# EAGLE design Teensy board (EAGLE 9.3.0)
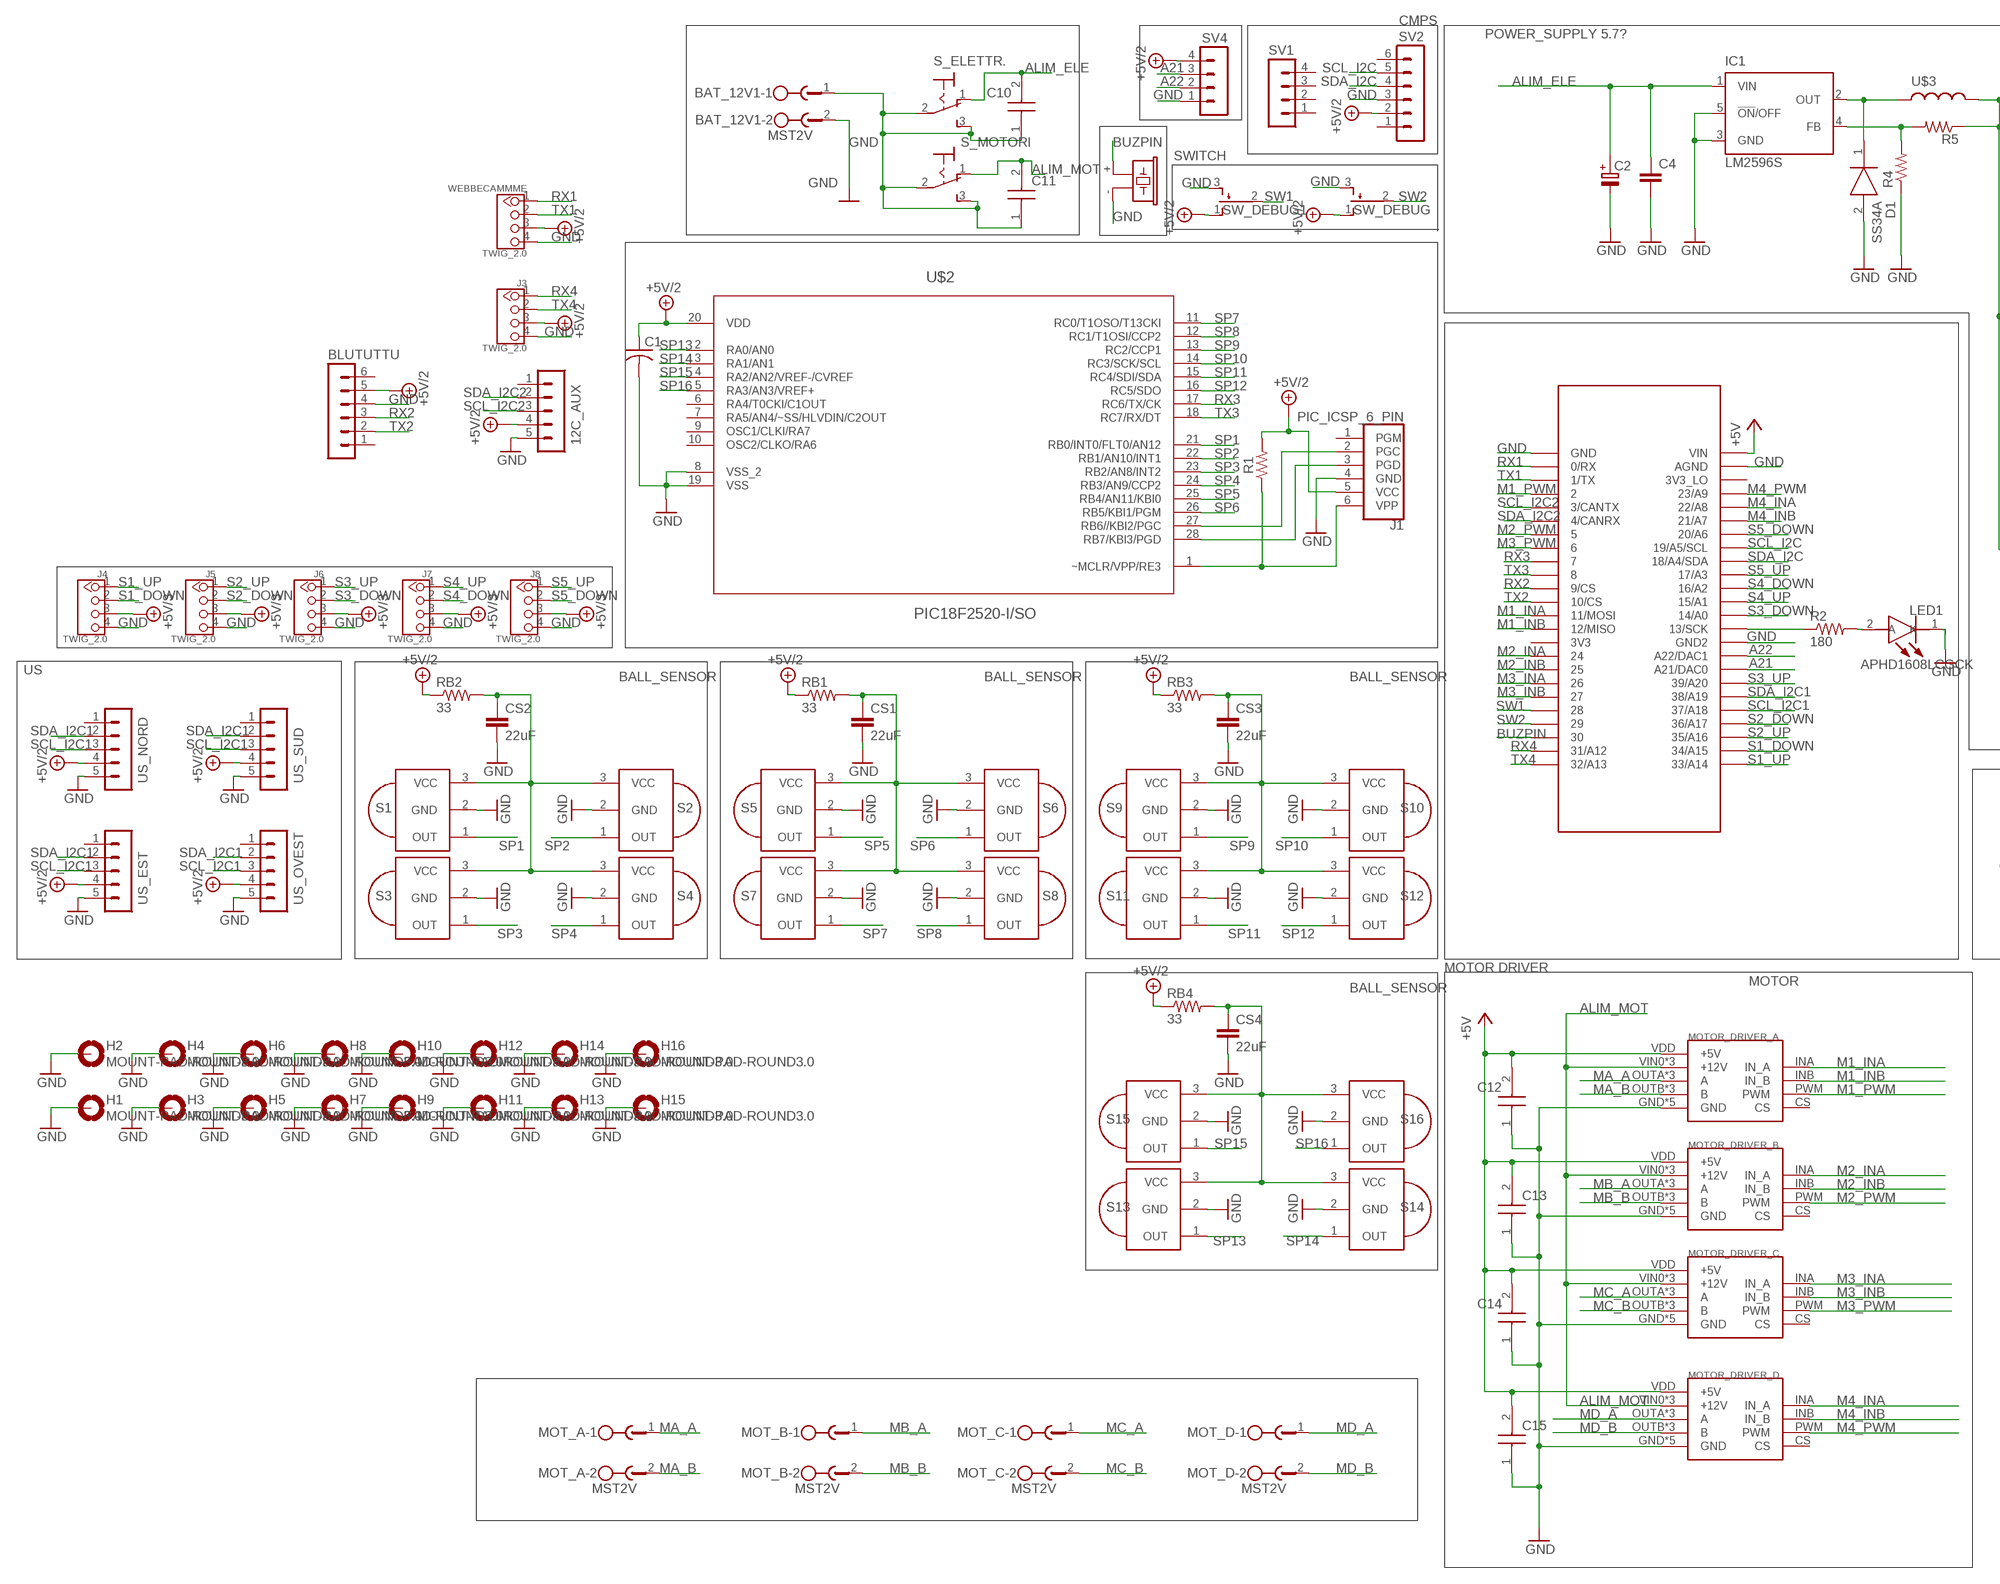
[diagram p0: schematic, sheet 1, part 1 of 2]
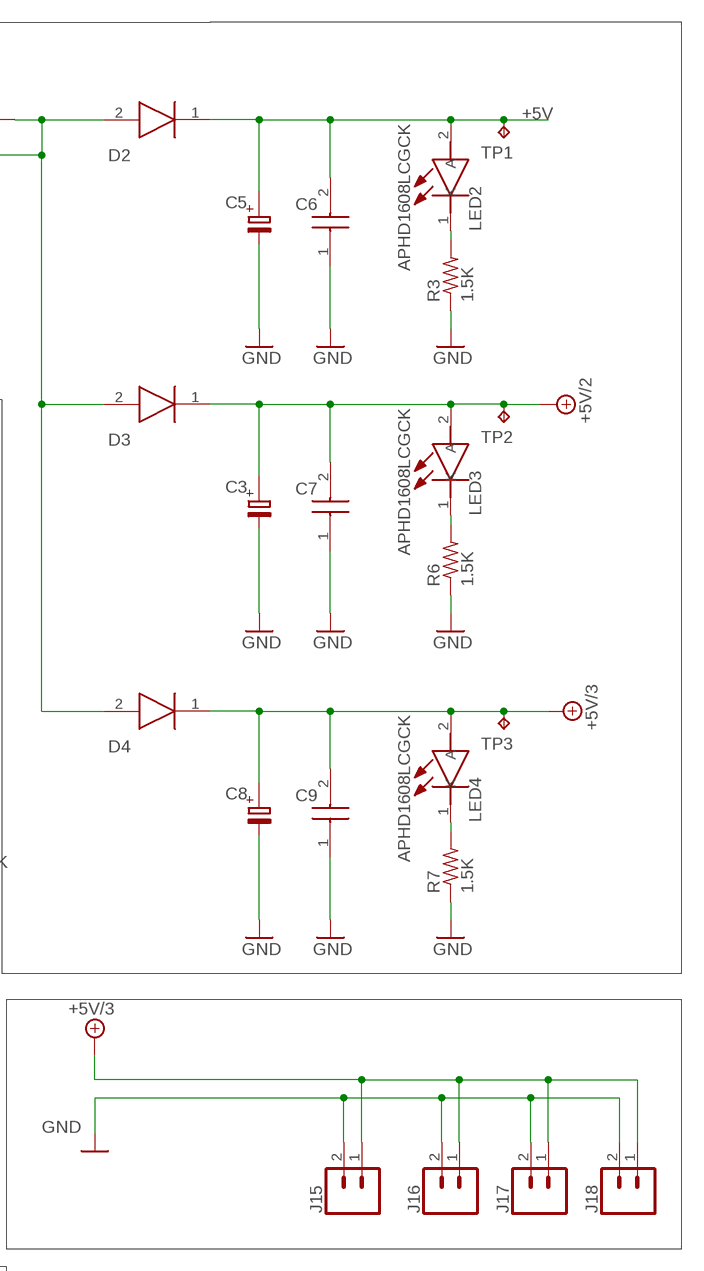
[diagram p1: schematic, sheet 1, part 2 of 2]

## Parts
12C_AUX  MA05-1  [MA05-1]
BAT_12V1  MST2V  [MSTBV2]
BLUTUTTU  MA06-1  [MA06-1]
C1  C-USC1206  [C1206]
C2  C-PR-SMD-SV-E/F  [SV-E/F]
C3  C-PR-SMD-SV-E/F  [SV-E/F]
C4  CC1206  [C1206]
C5  C-PR-SMD-SV-E/F  [SV-E/F]
C6  12065D106KAT2A  [CAPC3216X229N]
C7  12065D106KAT2A  [CAPC3216X229N]
C8  C-PR-SMD-SV-E/F  [SV-E/F]
C9  12065D106KAT2A  [CAPC3216X229N]
C10  12065D106KAT2A  [CAPC3216X229N]
C11  12065D106KAT2A  [CAPC3216X229N]
C12  12065D106KAT2A  [CAPC3216X229N]
C13  12065D106KAT2A  [CAPC3216X229N]
C14  12065D106KAT2A  [CAPC3216X229N]
C15  12065D106KAT2A  [CAPC3216X229N]
CS1  22uF  C-EUC1206  [C1206]
CS2  22uF  C-EUC1206  [C1206]
CS3  22uF  C-EUC1206  [C1206]
CS4  22uF  C-EUC1206  [C1206]
D1  SS34A  [DIOM5026X262N]
D2  SE20FG-M3_H  [SODFL3718X108N]
D3  SE20FG-M3_H  [SODFL3718X108N]
D4  SE20FG-M3_H  [SODFL3718X108N]
H1  MOUNT-PAD-ROUND3.0  [3,0-PAD]
H2  MOUNT-PAD-ROUND3.0  [3,0-PAD]
H3  MOUNT-PAD-ROUND3.0  [3,0-PAD]
H4  MOUNT-PAD-ROUND3.0  [3,0-PAD]
H5  MOUNT-PAD-ROUND3.0  [3,0-PAD]
H6  MOUNT-PAD-ROUND3.0  [3,0-PAD]
H7  MOUNT-PAD-ROUND3.0  [3,0-PAD]
H8  MOUNT-PAD-ROUND3.0  [3,0-PAD]
H9  MOUNT-PAD-ROUND3.0  [3,0-PAD]
H10  MOUNT-PAD-ROUND3.0  [3,0-PAD]
H11  MOUNT-PAD-ROUND3.0  [3,0-PAD]
H12  MOUNT-PAD-ROUND3.0  [3,0-PAD]
H13  MOUNT-PAD-ROUND3.0  [3,0-PAD]
H14  MOUNT-PAD-ROUND3.0  [3,0-PAD]
H15  MOUNT-PAD-ROUND3.0  [3,0-PAD]
H16  MOUNT-PAD-ROUND3.0  [3,0-PAD]
IC1  LM2596S  [TO263-5]
J1  PIC_ICSP_6_PIN  [MOLEX-1X6]
J3  TWIG_2.0  [2.0_1X4]
J4  TWIG_2.0  [2.0_1X4]
J5  TWIG_2.0  [2.0_1X4]
J6  TWIG_2.0  [2.0_1X4]
J7  TWIG_2.0  [2.0_1X4]
J8  TWIG_2.0  [2.0_1X4]
J15  CONN_02  [1X02]
J16  CONN_02  [1X02]
J17  CONN_02  [1X02]
J18  CONN_02  [1X02]
LED1  APHD1608LCGCK  [LEDM168X80N]
LED2  APHD1608LCGCK  [LEDM168X80N]
LED3  APHD1608LCGCK  [LEDM168X80N]
LED4  APHD1608LCGCK  [LEDM168X80N]
MOT_A  MST2V  [MSTBV2]
MOT_B  MST2V  [MSTBV2]
MOT_C  MST2V  [MSTBV2]
MOT_D  MST2V  [MSTBV2]
MOTOR_DRIVER_A  VNH5019  [VNH5019]
MOTOR_DRIVER_B  VNH5019  [VNH5019]
MOTOR_DRIVER_C  VNH5019  [VNH5019]
MOTOR_DRIVER_D  VNH5019  [VNH5019]
R1  10k  R-US_M1206  [M1206]
R2  180  R-US_M1206  [M1206]
R3  1.5K  R-US_R1206  [R1206]
R4  R-US_R1206  [R1206]
R5  R-US_R1206  [R1206]
R6  1.5K  R-US_R1206  [R1206]
R7  1.5K  R-US_R1206  [R1206]
RB1  33  R-US_M1206  [M1206]
RB2  33  R-US_M1206  [M1206]
RB3  33  R-US_M1206  [M1206]
RB4  33  R-US_M1206  [M1206]
S1  PNA460XM  [PNA460XM]
S2  PNA460XM  [PNA460XM]
S3  PNA460XM  [PNA460XM]
S4  PNA460XM  [PNA460XM]
S5  PNA460XM  [PNA460XM]
S6  PNA460XM  [PNA460XM]
S7  PNA460XM  [PNA460XM]
S8  PNA460XM  [PNA460XM]
S9  PNA460XM  [PNA460XM]
S10  PNA460XM  [PNA460XM]
S11  PNA460XM  [PNA460XM]
S12  PNA460XM  [PNA460XM]
S13  PNA460XM  [PNA460XM]
S14  PNA460XM  [PNA460XM]
S15  PNA460XM  [PNA460XM]
S16  PNA460XM  [PNA460XM]
S_ELETTR.  320-916  [320-916]
S_MOTORI  320-916  [320-916]
SG1  F/CM12P  [F/CM12P]
SV1  MA04-1  [MA04-1]
SV2  MA06-1  [MA06-1]
SV4  MA04-1  [MA04-1]
SW_DEBUG  TL38PO  [TL3XPO]
SW_DEBUG1  TL38PO  [TL3XPO]
TP1  TPTP13SQ  [TP13SQ]
TP2  TPTP13SQ  [TP13SQ]
TP3  TPTP13SQ  [TP13SQ]
U$1  TEENSY_3.5/3.6  [TEENSY_3.5/3.6]
U$2  PIC18F2520-I/SO  [SOIC127P1030X265-28N]
U$3  MSS1260  [MSS1260]
US_EST  MA05-1  [MA05-1]
US_NORD  MA05-1  [MA05-1]
US_OVEST  MA05-1  [MA05-1]
US_SUD  MA05-1  [MA05-1]
WEBBECAMMME  TWIG_2.0  [2.0_1X4]

## Nets
5.7V-DIRAMAZIONE2: D2.2(A) D3.2(A) D4.2(A) R5.1 U$3.P$1
+5V: C5.+ C6.2 D2.1(K) LED2.2(A) TP1.TP U$1.VIN
+5V/2: 12C_AUX.4 BLUTUTTU.5 C1.1 C3.+ C7.2 D3.1(K) J1.5(VCC) J3.3 LED3.2(A) R1.2 RB1.1 RB2.1 RB3.1 RB4.1 SV2.2 SV4.4 SW_DEBUG1.1(O) SW_DEBUG.1(O) TP2.TP U$2.20(VDD) US_EST.4 US_NORD.4 US_OVEST.4 US_SUD.4 WEBBECAMMME.3
+5V/3: C8.+ C9.2 D4.1(K) J4.3 J5.3 J6.3 J7.3 J8.3 J15.1 J16.1 J17.1 J18.1 LED4.2(A) TP3.TP
A21: SV4.3 U$1.21/DAC0(A21/DAC0)
A22: SV4.2 U$1.A22/DAC1
ALIM_ELE [Power]: C2.+ C4.1 C10.2 IC1.1(VIN) S_ELETTR..1(O)
ALIM_MOT [Power]: C11.2 MOTOR_DRIVER_A.VIN0(+12V) MOTOR_DRIVER_A.VIN1(+12V) MOTOR_DRIVER_A.VIN2(+12V) MOTOR_DRIVER_B.VIN0(+12V) MOTOR_DRIVER_B.VIN1(+12V) MOTOR_DRIVER_B.VIN2(+12V) MOTOR_DRIVER_C.VIN0(+12V) MOTOR_DRIVER_C.VIN1(+12V) MOTOR_DRIVER_C.VIN2(+12V) MOTOR_DRIVER_D.VIN0(+12V) MOTOR_DRIVER_D.VIN1(+12V) MOTOR_DRIVER_D.VIN2(+12V) S_MOTORI.1(O)
BUZPIN: SG1.+ U$1.30
GND [Power]: 12C_AUX.5 BAT_12V1.2 BLUTUTTU.4 C1.2 C2.- C3.- C4.2 C5.- C6.1 C7.1 C8.- C9.1 C12.1 C13.1 C14.1 C15.1 CS1.2 CS2.2 CS3.2 CS4.2 D1.2(A) H1.B3,0(MOUNT) H2.B3,0(MOUNT) H3.B3,0(MOUNT) H4.B3,0(MOUNT) H5.B3,0(MOUNT) H6.B3,0(MOUNT) H7.B3,0(MOUNT) H8.B3,0(MOUNT) H9.B3,0(MOUNT) H10.B3,0(MOUNT) H11.B3,0(MOUNT) H12.B3,0(MOUNT) H13.B3,0(MOUNT) H14.B3,0(MOUNT) H15.B3,0(MOUNT) H16.B3,0(MOUNT) IC1.3(GND) IC1.5(!ON!/OFF) J1.4(GND) J3.4 J4.4 J5.4 J6.4 J7.4 J8.4 J15.2 J16.2 J17.2 J18.2 LED1.1(K) MOTOR_DRIVER_A.GND MOTOR_DRIVER_A.GND0(GND) MOTOR_DRIVER_A.GND1(GND) MOTOR_DRIVER_A.GND2(GND) MOTOR_DRIVER_A.GND3(GND) MOTOR_DRIVER_B.GND MOTOR_DRIVER_B.GND0(GND) MOTOR_DRIVER_B.GND1(GND) MOTOR_DRIVER_B.GND2(GND) MOTOR_DRIVER_B.GND3(GND) MOTOR_DRIVER_C.GND MOTOR_DRIVER_C.GND0(GND) MOTOR_DRIVER_C.GND1(GND) MOTOR_DRIVER_C.GND2(GND) MOTOR_DRIVER_C.GND3(GND) MOTOR_DRIVER_D.GND MOTOR_DRIVER_D.GND0(GND) MOTOR_DRIVER_D.GND1(GND) MOTOR_DRIVER_D.GND2(GND) MOTOR_DRIVER_D.GND3(GND) R3.1 R4.1 R6.1 R7.1 S1.2(GND) S2.2(GND) S3.2(GND) S4.2(GND) S5.2(GND) S6.2(GND) S7.2(GND) S8.2(GND) S9.2(GND) S10.2(GND) S11.2(GND) S12.2(GND) S13.2(GND) S14.2(GND) S15.2(GND) S16.2(GND) SG1.- SV2.3 SV4.1 SW_DEBUG1.3(S) SW_DEBUG.3(S) U$1.AGND U$1.GND U$1.GND2 U$2.8(VSS_2) U$2.19(VSS) US_EST.5 US_NORD.5 US_OVEST.5 US_SUD.5 WEBBECAMMME.4
M1_INA: MOTOR_DRIVER_A.INA(IN_A) U$1.11/MOSI
M1_INB: MOTOR_DRIVER_A.INB(IN_B) U$1.12/MISO
M1_PWM: MOTOR_DRIVER_A.PWM U$1.2
M2_INA: MOTOR_DRIVER_B.INA(IN_A) U$1.24
M2_INB: MOTOR_DRIVER_B.INB(IN_B) U$1.25
M2_PWM: MOTOR_DRIVER_B.PWM U$1.5
M3_INA: MOTOR_DRIVER_C.INA(IN_A) U$1.26
M3_INB: MOTOR_DRIVER_C.INB(IN_B) U$1.27
M3_PWM: MOTOR_DRIVER_C.PWM U$1.6
M4_INA: MOTOR_DRIVER_D.INA(IN_A) U$1.22/A8
M4_INB: MOTOR_DRIVER_D.INB(IN_B) U$1.21/A7
M4_PWM: MOTOR_DRIVER_D.PWM U$1.23/A9
MA_A: MOT_A.1 MOTOR_DRIVER_A.OUTA2(A) MOTOR_DRIVER_A.OUTA3(A) MOTOR_DRIVER_A.OUTA(A)
MA_B: MOT_A.2 MOTOR_DRIVER_A.OUTB1(B) MOTOR_DRIVER_A.OUTB3(B) MOTOR_DRIVER_A.OUTB(B)
MB_A [Power]: MOT_B.1 MOTOR_DRIVER_B.OUTA2(A) MOTOR_DRIVER_B.OUTA3(A) MOTOR_DRIVER_B.OUTA(A)
MB_B [Power]: MOT_B.2 MOTOR_DRIVER_B.OUTB1(B) MOTOR_DRIVER_B.OUTB3(B) MOTOR_DRIVER_B.OUTB(B)
MC_A [Power]: MOT_C.1 MOTOR_DRIVER_C.OUTA2(A) MOTOR_DRIVER_C.OUTA3(A) MOTOR_DRIVER_C.OUTA(A)
MC_B [Power]: MOT_C.2 MOTOR_DRIVER_C.OUTB1(B) MOTOR_DRIVER_C.OUTB3(B) MOTOR_DRIVER_C.OUTB(B)
MD_A: MOT_D.1 MOTOR_DRIVER_D.OUTA2(A) MOTOR_DRIVER_D.OUTA3(A) MOTOR_DRIVER_D.OUTA(A)
MD_B: MOT_D.2 MOTOR_DRIVER_D.OUTB1(B) MOTOR_DRIVER_D.OUTB3(B) MOTOR_DRIVER_D.OUTB(B)
N$1: J1.6(VPP) R1.1 U$2.1(~MCLR/VPP/RE3)
N$2: J1.3(PGD) U$2.28(RB7/KBI3/PGD)
N$3: J1.2(PGC) U$2.27(RB6//KBI2/PGC)
N$4: R2.1 U$1.13/SCK
N$5: LED1.2(A) R2.2
N$6: C12.2 C13.2 C14.2 C15.2 D1.1(K) IC1.2(OUT) MOTOR_DRIVER_A.VDD(+5V) MOTOR_DRIVER_B.VDD(+5V) MOTOR_DRIVER_C.VDD(+5V) MOTOR_DRIVER_D.VDD(+5V) U$3.P$2 ; supply symbol labelled +5V
N$7: IC1.4(FB) R4.2 R5.2
N$8: LED2.1(K) R3.2
N$10: LED3.1(K) R6.2
N$12: LED4.1(K) R7.2
N$14: BAT_12V1.1 C10.1 C11.1 S_ELETTR..2(P) S_ELETTR..3(S) S_MOTORI.2(P) S_MOTORI.3(S)
POWER_BLOK_1: CS1.1 RB1.2 S5.3(VCC) S6.3(VCC) S7.3(VCC) S8.3(VCC)
POWER_BLOK_2: CS2.1 RB2.2 S1.3(VCC) S2.3(VCC) S3.3(VCC) S4.3(VCC)
POWER_BLOK_3: CS3.1 RB3.2 S9.3(VCC) S10.3(VCC) S11.3(VCC) S12.3(VCC)
POWER_BLOK_4: CS4.1 RB4.2 S13.3(VCC) S14.3(VCC) S15.3(VCC) S16.3(VCC)
RX1: U$1.0/RX WEBBECAMMME.1
RX2: BLUTUTTU.3 U$1.9/CS
RX3: U$1.7 U$2.17(RC6/TX/CK)
RX4: J3.1 U$1.31/A12
S1_DOWN: J4.2 U$1.34/A15
S1_UP: J4.1 U$1.33/A14
S2_DOWN: J5.2 U$1.36/A17
S2_UP: J5.1 U$1.35/A16
S3_DOWN: J6.2 U$1.14/A0
S3_UP: J6.1 U$1.39/A20
S4_DOWN: J7.2 U$1.16/A2
S4_UP: J7.1 U$1.15/A1
S5_DOWN: J8.2 U$1.20/A6
S5_UP: J8.1 U$1.17/A3
SCL_I2C: SV2.5 U$1.19/A5/SCL
SCL_I2C1: U$1.37/A18 US_EST.3 US_NORD.3 US_OVEST.3 US_SUD.3
SCL_I2C2: 12C_AUX.3 U$1.3/CANTX
SDA_I2C: SV2.4 U$1.18/A4/SDA
SDA_I2C1: U$1.38/A19 US_EST.2 US_NORD.2 US_OVEST.2 US_SUD.2
SDA_I2C2: 12C_AUX.2 U$1.4/CANRX
SP1: S1.1(OUT) U$2.21(RB0/INT0/FLT0/AN12)
SP2: S2.1(OUT) U$2.22(RB1/AN10/INT1)
SP3: S3.1(OUT) U$2.23(RB2/AN8/INT2)
SP4: S4.1(OUT) U$2.24(RB3/AN9/CCP2)
SP5: S5.1(OUT) U$2.25(RB4/AN11/KBI0)
SP6: S6.1(OUT) U$2.26(RB5/KBI1/PGM)
SP7: S7.1(OUT) U$2.11(RC0/T1OSO/T13CKI)
SP8: S8.1(OUT) U$2.12(RC1/T1OSI/CCP2)
SP9: S9.1(OUT) U$2.13(RC2/CCP1)
SP10: S10.1(OUT) U$2.14(RC3/SCK/SCL)
SP11: S11.1(OUT) U$2.15(RC4/SDI/SDA)
SP12: S12.1(OUT) U$2.16(RC5/SDO)
SP13: S13.1(OUT) U$2.2(RA0/AN0)
SP14: S14.1(OUT) U$2.3(RA1/AN1)
SP15: S15.1(OUT) U$2.4(RA2/AN2/VREF-/CVREF)
SP16: S16.1(OUT) U$2.5(RA3/AN3/VREF+)
SW1: SW_DEBUG1.2(P) U$1.28
SW2: SW_DEBUG.2(P) U$1.29
TX1: U$1.1/TX WEBBECAMMME.2
TX2: BLUTUTTU.2 U$1.10/CS
TX3: U$1.8 U$2.18(RC7/RX/DT)
TX4: J3.2 U$1.32/A13
Unconnected: 12C_AUX.1 BLUTUTTU.1 BLUTUTTU.6 J1.1(PGM) MOTOR_DRIVER_A.CS MOTOR_DRIVER_B.CS MOTOR_DRIVER_C.CS MOTOR_DRIVER_D.CS SV1.1 SV1.2 SV1.3 SV1.4 SV2.1 SV2.6 U$1.3V3 U$1.3V3_LO U$2.6(RA4/T0CKI/C1OUT) U$2.7(RA5/AN4/~SS/HLVDIN/C2OUT) U$2.9(OSC1/CLKI/RA7) U$2.10(OSC2/CLKO/RA6) US_EST.1 US_NORD.1 US_OVEST.1 US_SUD.1

## Notes on the sheet
- CMPS
- POWER_SUPPLY 5.7?
- SWITCH
- US
- BALL_SENSOR | BALL_SENSOR | BALL_SENSOR
- MOTOR DRIVER
- MOTOR
- BALL_SENSOR

## Library data of the parts
12C_AUX US_EST US_NORD US_OVEST US_SUD = con-lstb:MA05-1: PIN HEADER; OC_FARNELL: unknown; OC_NEWARK: unknown
BAT_12V1 MOT_A MOT_B MOT_C MOT_D = con-phoenix-508:MST2V: PHOENIX; OC_FARNELL: unknown; OC_NEWARK: unknown
BLUTUTTU SV2 = con-lstb:MA06-1: PIN HEADER; OC_FARNELL: unknown; OC_NEWARK: unknown
C1 = adafruit:C-US: CAPACITOR, American symbol
C2 C3 C5 C8 = cap-pan40:C-PR: POLARIZED ELECTROLYTIC/TANTALUM
C4 = eagle-ltspice:C: CAPACITOR, European symbol; SPICEMODEL: NONE; SPICEPREFIX: C
C6 C7 C9-C15 = 12065D106KAT2A:12065D106KAT2A: Multilayer Ceramic Capacitors MLCC - SMD/SMT 50V 10uF X5R 1206 10% HIGH CV Source: Datasheet <http://datasheets.avx.com/cx5r.pdf>; DESCRIPTION: Multilayer Ceramic Capacitors MLCC - SMD/SMT 50V 10uF X5R 1206 10% HIGH CV; HEIGHT: 2.29mm; MANUFACTURER_NAME: AVX; MANUFACTURER_PART_NUMBER: 12065D106KAT2A
CS1-CS4 = rcl:C-EU: CAPACITOR, European symbol
D1 = SamacSys_Parts:SS34A: HY Electronic Corp SS34A, SMT Rectifier Schottky Diode, 40V 3A, 2-Pin SMA Source: Datasheet <http://uk.rs-online.com/web/p/products/1711454>; DESCRIPTION: HY Electronic Corp SS34A, SMT Rectifier Schottky Diode, 40V 3A, 2-Pin SMA; HEIGHT: 2.62mm; MANUFACTURER_NAME: HY Electronic Corp; MANUFACTURER_PART_NUMBER: SS34A; RS_PART_NUMBER: 1711454
D2-D4 = SE20FG-M3_H:SE20FG-M3_H: Diode Rectifier 2A 400V Standard DO219AB Vishay SE20FG-M3/H, SMT Diode, 400V 2A, 920ns, 2-Pin DO-219AB Source: Datasheet <http://uk.rs-online.com/web/p/products/8949262P>; DESCRIPTION: Diode Rectifier 2A 400V Standard DO219AB Vishay SE20FG-M3/H, SMT Diode, 400V 2A, 920ns, 2-Pin DO-219AB; HEIGHT: 1.08mm; MANUFACTURER_NAME: Vishay; MANUFACTURER_PART_NUMBER: SE20FG-M3/H; RS_PART_NUMBER: 8949262P
H1-H16 = holes:MOUNT-PAD-ROUND: MOUNTING PAD, round
IC1 = national-semiconductor:LM2596: SIMPLE SWITCHER® Power Converter 150 kHz 3A Step-Down Voltage Regulator Source: http://www.national.com/ds/LM/LM2596.pdf; MF: NATIONAL SEMICONDUCTOR; MPN: LM2596S-ADJ/NOPB; OC_FARNELL: 9494367; OC_NEWARK: 41K3842
J1 = SparkFun-Connectors:PIC_ICSP_6_PIN: ISCP Programming connector for PICs This 6 pin header contains all the lines necessary for programming most PIC microcontrollers. Here is the connector we sell at SparkFun: Polarized Connectors - Header (6-Pin) <https://www.sparkfun.com/products/8094> (PRT-08094) It is used on this SparkFun product: SparkFun UDB5 - PIC UAV Development Board <https://www.sparkfun.com/products/11703> (DEV-11703) Also, if you need a nice PIC programmer, please check these out: MPLAB PICkit 3 <https://www.sparkfun.com/products/9973> (PGM-09973); PROD_ID: CONN-08046; SF_ID: PRT-08094
J3-J8 WEBBECAMMME = CONNECTER:TWIG_2.0
J15-J18 = SparkFun-Connectors:CONN_02: Multi connection point. Often used as Generic Header-pin footprint for 0.1 inch spaced/style header connections On any of the 0.1 inch spaced packages, you can populate with these: Break Away Headers - Straight <https://www.sparkfun.com/products/116> (PRT-00116) Break Away Male Headers - Right Angle <https://www.sparkfun.com/products/553> (PRT-00553) Female Headers <https://www.sparkfun.com/products/115> (PRT-00115) Break Away Headers - Machine Pin <https://www.sparkfun.com/products/117> (PRT-00117) Break Away Female Headers - Swiss Machine Pin <https://www.sparkfun.com/products/743> (PRT-00743) For SCREWTERMINALS and SPRING TERMINALS visit here: Screw Terimnals on SparkFun.com <https://www.sparkfun.com/search/results?term=Screw+Terminals> (5mm/3.5mm/2.54mm spacing) This device is also useful as a general connection point to wire up your design to another part of your project. Our various solder wires solder well into these plated through hole pads. Hook-Up Wire - Assortment (Stranded, 22 AWG) <https://www.sparkfun.com/products/11375> (PRT-11375) Hook-Up Wire - Assortment (Solid Core, 22 AWG) <https://www.sparkfun.com/products/11367> (PRT-11367) View the entire wire category on our website here <https://www.sparkfun.com/categories/141> Special notes: Molex polarized connector foot print use with: PRT-08233 with associated crimp pins and housings. 2.54_SCREWTERM for use with PRT-10571. 3.5mm Screw Terminal footprints for PRT-08084 5mm Screw Terminal footprints for use with PRT-08432
LED1-LED4 = SamacSys_Parts:APHD1608LCGCK: Standard LEDs - SMD 0603 Dome Lens LED Green- 570nm Source: Datasheet <http://www.mouser.com/datasheet/2/216/APHD1608LCGCK-1100472.pdf>; DESCRIPTION: Standard LEDs - SMD 0603 Dome Lens LED Green- 570nm; HEIGHT: 0.8mm; MANUFACTURER_NAME: Kingbright; MANUFACTURER_PART_NUMBER: APHD1608LCGCK; MOUSER_PART_NUMBER: 604-APHD1608LCGCK
MOTOR_DRIVER_A MOTOR_DRIVER_B MOTOR_DRIVER_C MOTOR_DRIVER_D = DRIVER POLOLU:VNH5019: aggiornato il 24/10/14 con pin cs (AD)
R1-R7 RB1-RB4 = adafruit:R-US_: RESISTOR, American symbol
S1-S16 = adafruit:PNA460XM: IR 38KHz receiver PNA4602 and related receivers http://www.ladyada.net/library/pcb/eaglelibrary.html
S_ELETTR. S_MOTORI = switch:320-916: TOGGLE SWITCH distributor RS Components
SG1 = buzzer:F/CM12P: BUZZER Source: Buerklin; OC_FARNELL: unknown; OC_NEWARK: unknown
SV1 SV4 = con-lstb:MA04-1: PIN HEADER; OC_FARNELL: unknown; OC_NEWARK: unknown
SW_DEBUG SW_DEBUG1 = switch:TL38PO: TINY SWITCH ON OFF MOM Source: http://www2.produktinfo.conrad.com/datenblaetter/700000-724999/705152-da-01-de-Subminiaturschalter_TL_36YO.pdf
TP1-TP3 = testpad:TP: Test pad
U$1 = Teensy356:TEENSY_3.5/3.6
U$2 = Microchip_By_element14_Batch_1:PIC18F2520-I/SO: Enhanced Flash Microcontroller; DESCRIPTION: Enhanced Flash Microcontroller; MPN: PIC18F2520-I/SO; OC_FARNELL: 9321241; OC_NEWARK: 89H0593; PACKAGE: SOIC-28; SUPPLIER: Microchip
U$3 = inductor-coilcraft:MSS1260: SMT Power Inductor

## Net classes
0 default: width 0.254 mm
1 Power: width 0.508 mm, clearance 0.508 mm
2 Power mot: width 1.93 mm

## Board
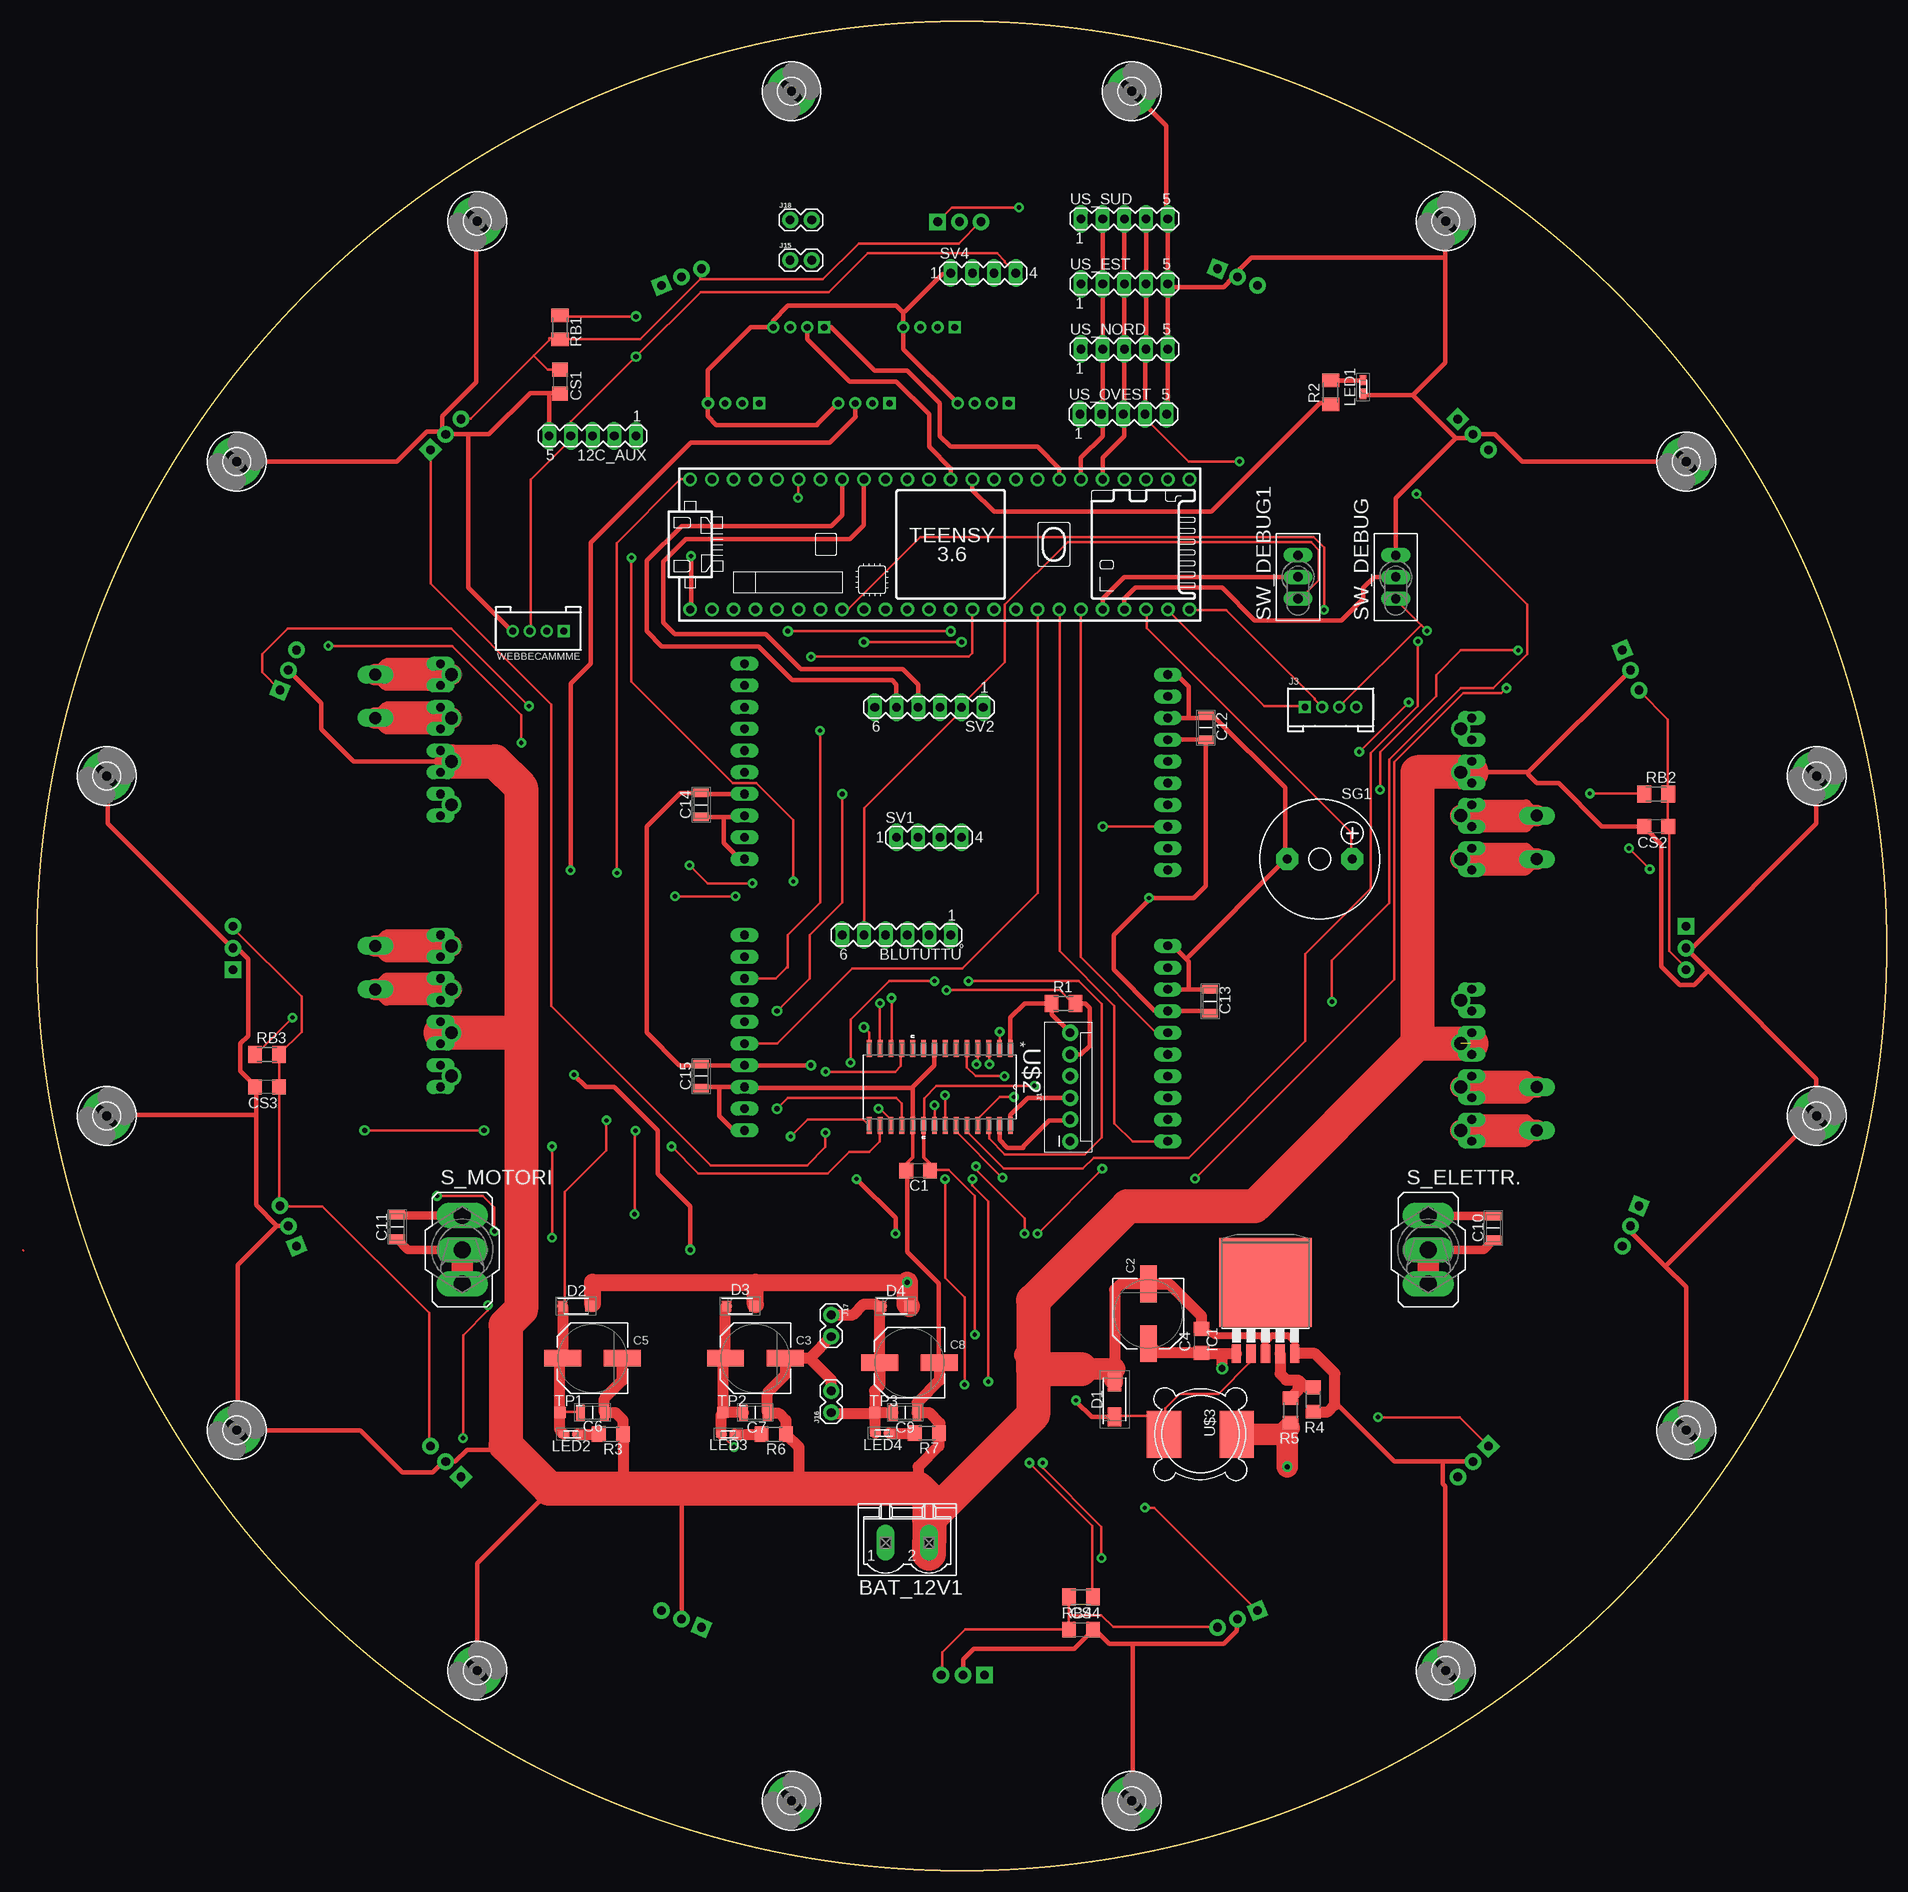
[diagram p2: board, top side]
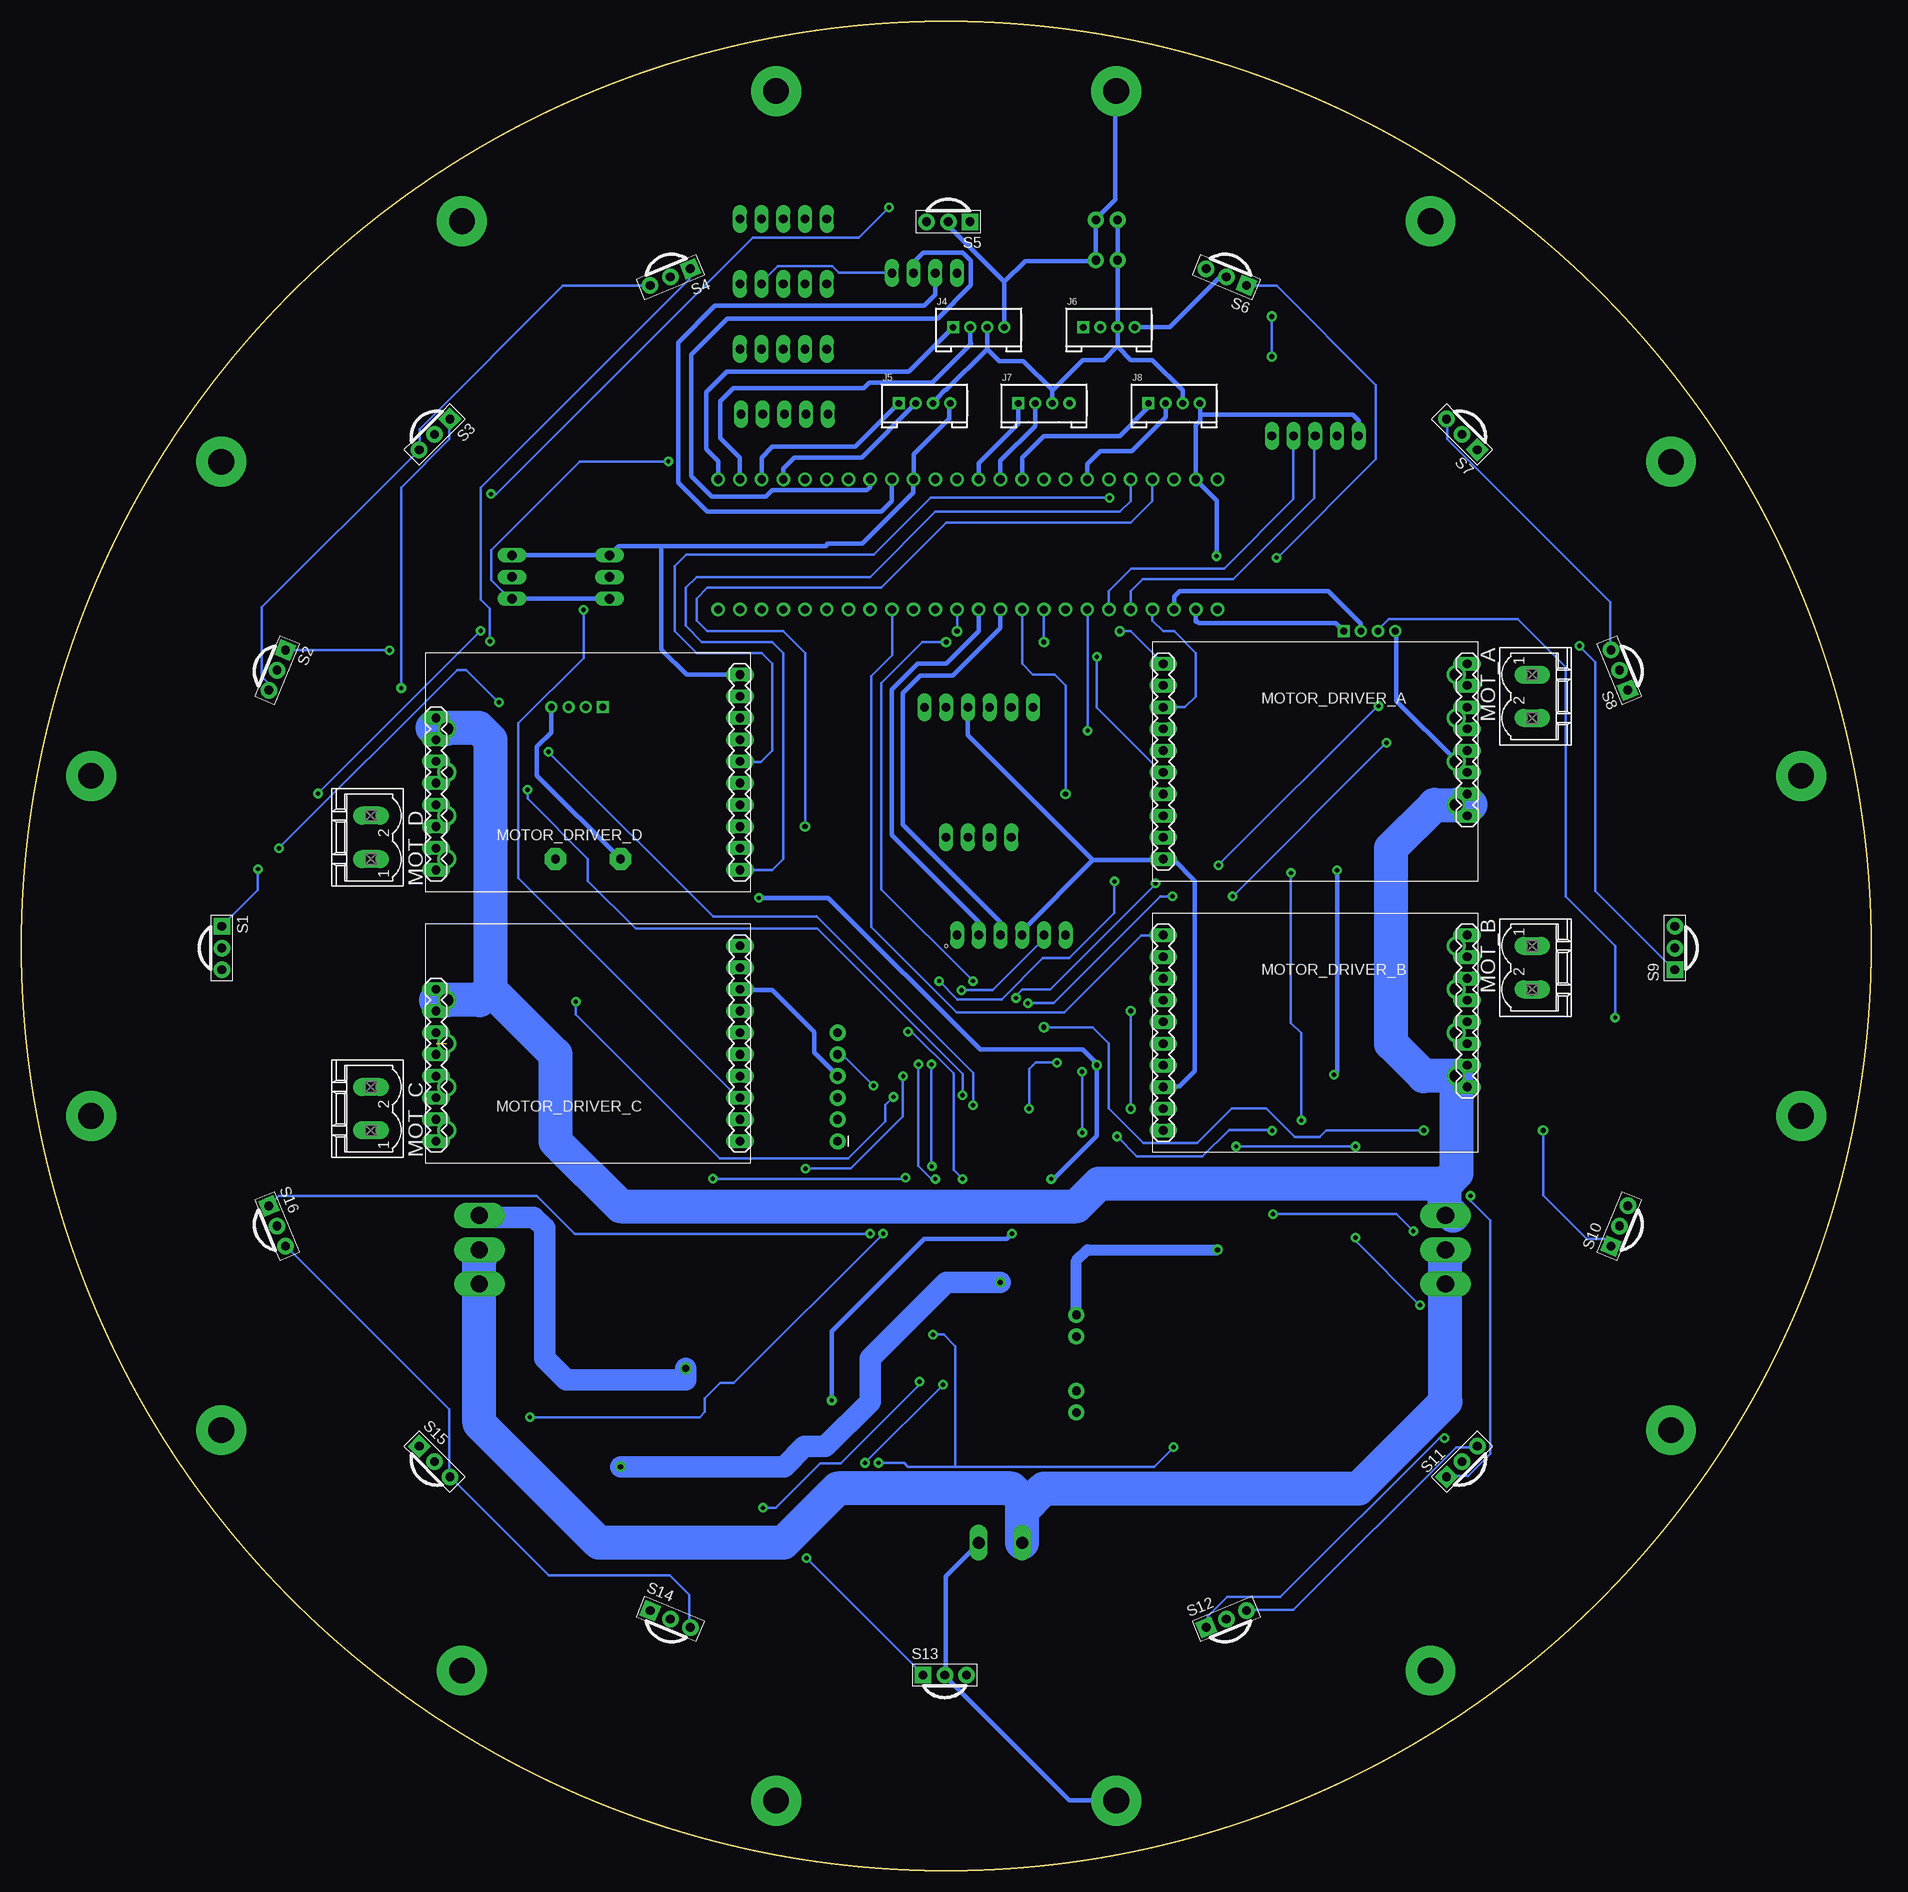
[diagram p3: board, bottom side, seen from below]

Size 216.41 x 216.41 mm. Coordinates in mm from the lower left corner, seen from the top.
Outline: circle at 108.2,108.2 radius 108.2
Copper layers (1*16): Top 0.035mm / dielectric 1.5mm / Bottom 0.035mm
Design rules "SparkFun-2-layer-STANDARD *": minimum track width 12mil, minimum drill 20mil, track to track 12mil, track to pad 12mil, pad to pad 12mil, via to via 12mil, smd to smd 12mil, copper to edge 12mil, drill to drill 12mil, minimum pad ring 12mil, minimum via ring 12mil, stop-mask expansion 4mil, vias tented up to drill 25mil, thermal gap 10mil
Holes 0.35 mm at 108.2,108.2

### Footprints (pad centres in the part's own frame; a part is rotated, then mirrored left to right if it is on the bottom)
MA05-1 = drill 1.016 long: 1 -5.08,0; 2 -2.54,0; 3 0,0; 4 2.54,0; 5 5.08,0
MSTBV2 = drill 1.397 long: 1 -2.54,0; 2 2.54,0
MA06-1 = drill 1.016 long: 1 -6.35,0; 2 -3.81,0; 3 -1.27,0; 4 1.27,0; 5 3.81,0; 6 6.35,0
C1206 = smd 1.6 x 1.8: 1 -1.4,0; 2 1.4,0
SV-E/F = smd 4.318 x 1.93: + -3.493,0; - 3.493,0
CAPC3216X229N = smd 1.02 x 1.82: 1 -1.4,0; 2 1.4,0
DIOM5026X262N = smd 2.2 x 1.55: 1 -2.05,0; 2 2.05,0
SODFL3718X108N = smd 1.12 x 1.22: 1 -1.6,0; 2 1.6,0
3,0-PAD = drill 3 pad 5.842: B3,0 0,0
TO263-5 = smd 1.067 x 2.159: 1 -3.404,-5.791; 2 -1.702,-5.791; 3 0,-5.791; 4 1.702,-5.791; 5 3.404,-5.791 | smd 10.8 x 10.41: 6 0,2.54
MOLEX-1X6 = drill 1.016 pad 1.88: 1 0,0; 2 2.54,0; 3 5.08,0; 4 7.62,0; 5 10.16,0; 6 12.7,0
2.0_1X4 = drill 0.8 pad 1.27 square: 1 -3,0 | drill 0.8 pad 1.27: 2 -1,0; 3 1,0; 4 3,0
1X02 = drill 1.016 pad 1.88: 1 0,0; 2 2.54,0
LEDM168X80N = smd 1.2 x 0.75: 1 -0.8,0; 2 0.8,0
VNH5019 = drill 1.016 long: CS 1.27,17.78; ENA 1.27,22.86; ENB 1.27,15.24; GND 1.27,7.62; GND0 36.83,12.7; GND1 1.27,2.54; GND2 36.83,15.24; INA 1.27,25.4; INB 1.27,12.7; OUTA 36.83,22.86; OUTA2 36.83,25.4; OUTB 36.83,17.78; OUTB1 36.83,20.32; PWM 1.27,20.32; VDD 1.27,10.16; VIN0 36.83,7.62; VIN1 36.83,10.16; VOUT 1.27,5.08 | drill 1.5: GND3 35.56,13.97; OUTA3 35.56,24.13; OUTB3 35.56,19.05; VIN2 35.56,8.89
M1206 = smd 1.6 x 2: 1 -1.4,0; 2 1.4,0
R1206 = smd 1.6 x 1.803: 1 -1.422,0; 2 1.422,0
PNA460XM = drill 1.016 pad 1.93 square: 1 -2.54,0 | drill 1.016 pad 1.93: 2 0,0; 3 2.54,0
320-916 = drill 2.007 long: 1 0,4.013; 2 0,0; 3 0,-4.013
F/CM12P = drill 1.016 pad 2.54 octagon: + 3.81,0; - -3.81,0
MA04-1 = drill 1.016 long: 1 -3.81,0; 2 -1.27,0; 3 1.27,0; 4 3.81,0
TL3XPO = drill 1.1 pad 1.422 long: 1 -2.54,0; 2 0,0; 3 2.54,0
TP13SQ = smd 1.3 x 1.3: TP 0,0
TEENSY_3.5/3.6 = drill 0.965: 0/RX -25.4,-7.62; 1/TX -22.86,-7.62; 2 -20.32,-7.62; 3/CANTX -17.78,-7.62; 3V3 7.62,-7.62; 3V3_LO -22.86,7.62; 4/CANRX -15.24,-7.62; 5 -12.7,-7.62; 6 -10.16,-7.62; 7 -7.62,-7.62; 8 -5.08,-7.62; 9/CS -2.54,-7.62; 10/CS 0,-7.62; 11/MOSI 2.54,-7.62; 12/MISO 5.08,-7.62; 13/SCK 5.08,7.62; 14/A0 2.54,7.62; 15/A1 0,7.62; 16/A2 -2.54,7.62; 17/A3 -5.08,7.62; 18/A4/SDA -7.62,7.62; 19/A5/SCL -10.16,7.62; 20/A6 -12.7,7.62; 21/A7 -15.24,7.62; 21/DAC0 12.7,7.62; 22/A8 -17.78,7.62; 23/A9 -20.32,7.62; 24 10.16,-7.62; 25 12.7,-7.62; 26 15.24,-7.62; 27 17.78,-7.62; 28 20.32,-7.62; 29 22.86,-7.62; 30 25.4,-7.62; 31/A12 27.94,-7.62; 32/A13 30.48,-7.62; 33/A14 30.48,7.62; 34/A15 27.94,7.62; 35/A16 25.4,7.62; 36/A17 22.86,7.62; 37/A18 20.32,7.62; 38/A19 17.78,7.62; 39/A20 15.24,7.62; A22/DAC1 10.16,7.62; AGND -25.4,7.62; GND -27.94,-7.62; GND2 7.62,7.62; VIN -27.94,7.62
SOIC127P1030X265-28N = smd 1.981 x 0.559: 1 -4.521,8.255; 2 -4.521,6.985; 3 -4.521,5.715; 4 -4.521,4.445; 5 -4.521,3.175; 6 -4.521,1.905; 7 -4.521,0.635; 8 -4.521,-0.635; 9 -4.521,-1.905; 10 -4.521,-3.175; 11 -4.521,-4.445; 12 -4.521,-5.715; 13 -4.521,-6.985; 14 -4.521,-8.255; 15 4.521,-8.255; 16 4.521,-6.985; 17 4.521,-5.715; 18 4.521,-4.445; 19 4.521,-3.175; 20 4.521,-1.905; 21 4.521,-0.635; 22 4.521,0.635; 23 4.521,1.905; 24 4.521,3.175; 25 4.521,4.445; 26 4.521,5.715; 27 4.521,6.985; 28 4.521,8.255
MSS1260 = smd 5.5 x 4: P$1 0,4.25; P$2 0,-4.25

### Placement (x,y rotation side)
12C_AUX  65.02,167.89 180 top
BAT_12V1  101.85,38.35 0 top
BLUTUTTU  100.58,109.47 180 top
C1  103.12,81.91 180 top
C2  130.05,65.15 90 top
C3  84.07,59.94 0 top
C4  136.27,61.98 90 top
C5  65.02,59.94 0 top
C6  65.02,53.59 180 top
C7  84.07,53.59 180 top
C8  102.11,59.44 0 top
C9  101.6,53.59 180 top
C10  170.43,75.18 90 top
C11  42.16,75.31 90 top
C12  136.78,133.73 270 top
C13  137.29,101.73 270 top
C14  77.72,124.71 90 top
C15  77.72,92.96 90 top
CS1  61.21,174.24 270 top
CS2  189.48,122.17 180 top
CS3  26.92,91.69 180 top
CS4  122.17,28.19 0 top
D1  126.11,55.12 90 top
D2  63.12,66.04 0 top
D3  82.3,66.04 0 top
D4  100.46,66.04 0 top
H1  208.24,128.1 0 top
H2  193.01,164.87 0 top
H3  164.87,193.01 0 top
H4  128.1,208.24 0 top
H5  88.3,208.24 0 top
H6  51.54,193.01 0 top
H7  23.39,164.87 0 top
H8  8.16,128.1 0 top
H9  8.16,88.3 0 top
H10  23.39,51.54 0 top
H11  51.54,23.39 0 top
H12  88.3,8.16 0 top
H13  128.1,8.16 0 top
H14  164.87,23.39 0 top
H15  193.01,51.54 0 top
H16  208.24,88.3 0 top
IC1  143.76,66.29 0 top
J1  120.9,85.34 90 top
J3  151.38,136.14 0 top
J4  104.39,180.59 0 bottom
J5  110.74,171.7 0 bottom
J6  89.15,180.59 0 bottom
J7  96.77,171.7 0 bottom
J8  81.53,171.7 0 bottom
J15  88.14,188.47 0 top
J16  92.96,53.59 90 top
J17  92.96,65.02 270 top
J18  88.14,193.17 0 top
LED1  155.19,173.61 90 top
LED2  62.48,51.05 180 top
LED3  80.9,51.05 180 top
LED4  98.93,51.18 180 top
MOT_A  39.62,137.41 270 bottom
MOT_B  39.62,105.66 270 bottom
MOT_C  175.51,89.15 90 bottom
MOT_D  175.51,120.9 90 bottom
MOTOR_DRIVER_A  84.07,115.82 0 bottom
MOTOR_DRIVER_B  84.07,84.07 0 bottom
MOTOR_DRIVER_C  131.06,110.74 180 bottom
MOTOR_DRIVER_D  131.06,142.49 180 bottom
R1  120.14,101.47 0 top
R2  151.38,172.97 90 top
R3  67.18,51.05 180 top
R4  149.35,55.12 90 top
R5  146.69,53.85 90 top
R6  86.23,51.05 180 top
R7  104.14,51.18 180 top
RB1  61.21,180.59 270 top
RB2  189.48,125.98 0 top
RB3  26.92,95.5 0 top
RB4  122.17,32 180 top
S1  192.95,107.95 270 bottom
S2  186.48,140.48 247.5 bottom
S3  168.06,168.06 225 bottom
S4  140.48,186.48 202.5 bottom
S5  107.95,192.95 180 bottom
S6  75.43,186.48 157.5 bottom
S7  47.85,168.06 135 bottom
S8  29.42,140.48 112.5 bottom
S9  22.95,107.95 90 bottom
S10  29.42,75.43 67.5 bottom
S11  47.85,47.85 45 bottom
S12  75.43,29.42 22.5 bottom
S13  108.36,22.86 0 bottom
S14  140.48,29.42 337.5 bottom
S15  168.06,47.85 315 bottom
S16  186.48,75.43 292.5 bottom
S_ELETTR.  162.81,72.64 0 top
S_MOTORI  49.78,72.64 0 top
SG1  150.11,118.36 0 top
SV1  104.39,120.9 0 top
SV2  104.39,136.14 180 top
SV4  110.74,186.94 0 top
SW_DEBUG  159,151.38 90 top
SW_DEBUG1  147.57,151.38 90 top
TP1  61.21,53.59 0 top
TP2  80.26,53.59 0 top
TP3  98.04,53.59 0 top
U$1  104.39,155.19 0 top
U$2  105.66,91.69 270 top
U$3  136.14,51.05 270 top
US_EST  127.25,185.67 0 top
US_NORD  127.25,178.05 0 top
US_OVEST  127.13,170.43 0 top
US_SUD  127.25,193.29 0 top
WEBBECAMMME  58.67,145.03 180 top

### Tracks (layer width: path | path; a pad name or v marks a point on that pad's centre or on a via)
5.7V-DIRAMAZIONE2  (via drill 0.6)
  Top 0.305: 140.74,50.88 140.34,51.28 U$3.P$1
  Top 1.016: U$3.P$1 140.77,50.68 | R5.1 145.8,51.54 145.8,51.05
  Top 1.27: D2.2 65.02,66.34 | v101.85,68.83 102.06,68.63 | D3.2 84.07,66.22
  Top 2: 65.02,66.34 65.02,68.83 84.07,68.83 | 84.07,68.83 v101.85,68.83 | 84.07,66.22 84.07,68.83
  Top 2.54: U$3.P$1 145.8,51.05 | 145.8,51.05 146.56,51.82 | v146.3,47.24 146.3,50.55 145.8,51.05 | v101.85,68.83 101.85,66.24 D4.2
  Bottom 2.54: v101.85,68.83 108.2,68.83 117.09,59.94 117.09,54.86 122.35,49.61 124.79,49.61 127.16,47.24 v146.3,47.24
+5V  (via drill 0.51)
  Top 0.305: C6.2 63.6,53.64 61.77,53.64 TP1.TP | v66.65,87.78 66.65,84.28 61.77,79.4 61.77,66.6 D2.1 | v67.87,116.74 67.87,148.74 67.84,148.77 67.84,155.35 75.31,162.81 U$1.VIN
  Top 1.27: D2.1 61.52,59.96 | 61.52,59.96 C5.+ | 61.52,59.96 61.21,59.65 TP1.TP 61.21,51.52 LED2.2
  Bottom 0.305: v66.65,87.78 66.65,97.99 67.87,99.21 v67.87,116.74
+5V/2  (via drill 0.51, 0.6)
  Top 0.305: v116.13,47.7 123.49,40.33 123.49,32 RB4.1 | v81.58,49.53 80.52,50.6 LED3.2 | v116.71,91.85 116.66,91.8 105.26,91.8 103.83,90.37 103.83,87.32 U$2.20 | BLUTUTTU.5 96.83,109.58 96.83,124.36 108.1,135.64 108.1,136.09 SV2.2 108.1,136.25 113.28,141.43 113.28,148.13 120.6,155.45 149.1,155.45 150.01,154.53 150.01,151.03 147.88,148.89 147.57,148.89 SW_DEBUG1.1 | v106.43,103.02 119.69,103.02 121.06,101.65 121.36,101.65 R1.2 | v109.75,62.71 109.75,78.97 106.73,81.99 104.6,81.99 C1.1 | v181.71,126.03 187.96,126.03 RB2.1 | 161.98,145.77 159,148.74 SW_DEBUG.1 | 161.98,145.77 v162.66,145.08 | 161.98,145.77 152.45,136.25 J3.3 | v29.92,99.82 25.65,95.55 RB3.1 | 57.81,145.08 WEBBECAMMME.3 57.81,145.24 57.81,162.76 62.38,167.33 62.38,167.79 12C_AUX.4 62.48,169.54 v70.1,177.16 77.67,184.73 92.69,184.73 97.23,189.28 112.37,189.28 113.28,188.37 113.28,188.21 SV4.4 | v140.72,164.9 134.77,164.9 129.74,169.93 129.74,170.23 US_OVEST.4 | RB1.1 61.34,181.86 v70.1,181.86
  Top 0.406: C1.1 104.52,82.67 103.76,83.44 U$2.20
  Top 0.508: J1.5 122.17,95.5 123.19,96.52 123.19,100.96 122.68,101.47 R1.2 | US_SUD.4 US_EST.4 US_NORD.4 129.67,177.93 US_OVEST.4
  Top 1.27: TP2.TP 80.26,59.63 C3.+ 80.58,65.93 D3.1 | C7.2 TP2.TP | LED3.2 80.1,53.43 TP2.TP
  Bottom 0.305: v116.13,47.7 113.13,47.7 112.67,47.24 107.11,47.24 | 107.11,47.24 83.87,47.24 v81.58,49.53 | J1.5 120.37,95.5 v116.71,91.85 | v106.43,103.02 102.77,103.02 96.83,108.97 96.83,109.42 BLUTUTTU.5 | 107.11,47.24 107.11,61.34 108.48,62.71 v109.75,62.71 | v162.66,145.08 v181.71,126.03 | SV4.4 114.66,187 120.75,187 121.51,187.76 127.91,187.76 129.9,185.78 US_EST.4 | v29.92,99.82 29.92,108.2 35.71,113.99 35.71,140.82 41.35,146.46 56.44,146.46 57.66,145.24 WEBBECAMMME.3 | v140.72,164.9 151.08,164.9 161.44,154.53 161.44,151.03 159.46,149.05 159.16,149.05 SW_DEBUG.1 | 108.1,136.7 108.1,136.25 SV2.2 | v70.1,181.86 v70.1,177.16
  Bottom 0.508: SW_DEBUG1.1 SW_DEBUG.1
+5V/3  (via drill 0.51, 0.6)
  Top 0.305: 95.77,170.16 95.81,170.13
  Top 0.508: v62.46,117.07 62.46,138.91 64.82,141.27 64.82,155.42 76.51,167.11 92.79,167.11 95.81,170.13 | v62.84,93.12 64.26,91.69 67.56,91.69 72.64,86.61 72.64,81.53 76.45,77.72 v76.45,72.64 | J7.3 95.77,170.16
  Top 1.27: TP3.TP 98.04,56.13 98.62,56.71 C8.+ 98.62,65.8 | TP3.TP C9.2 | LED4.2 98.13,53.5 | 98.13,53.5 TP3.TP | 98.62,65.8 D4.1 | J16.1 93.05,53.5 98.13,53.5 | J17.1 95.5,65.02 96.77,66.29 98.12,66.29 98.62,65.8
  Bottom 0.305: 62.46,93.5 v62.84,93.12
  Bottom 0.508: J8.3 80.53,173.24 84.07,176.78 86.61,176.78 88.14,178.31 88.14,178.44 | 88.14,178.44 88.14,180.58 J6.3 88.14,180.61 J15.1 J18.1 | 88.14,178.44 89.79,176.78 92.2,176.78 95.76,173.23 | 103.39,178.05 J4.3 | J5.3 109.26,172.19 109.26,172.33 108.37,173.22 108.23,173.22 103.39,178.05 | 103.39,178.05 102,176.66 99.19,176.66 95.76,173.23 | J7.3 95.77,173.21 95.76,173.23 | v62.46,117.07 62.46,93.5
  Bottom 1.27: J17.1 92.96,71.37 91.69,72.64 v76.45,72.64
A21
  Bottom 0.508: U$1.21/DAC0 117.09,161.92 117.48,161.54 128.52,161.54 129.29,160.78 135.64,160.78 138.02,163.17 138.02,177.42 133.81,181.63 109.18,181.63 105.31,185.51 105.31,188.38 106.26,189.33 110.9,189.33 112.01,188.21 SV4.3
A22
  Bottom 0.508: SV4.2 109.47,184.4 110.74,183.13 135.25,183.13 139.57,178.82 139.57,162.43 136.14,159 115.82,159 114.55,160.27 U$1.A22/DAC1
ALIM_ELE  (via drill 0.8)
  Top 1.016: S_ELETTR..1 162.89,76.58 C10.2
  Top 1.27: C2.+ 131.13,60.58 C4.1 136.34,60.5 138.68,60.5 | 138.68,60.5 IC1.1 | v138.68,58.77 138.68,60.5
  Bottom 2.54: S_ELETTR..1 162.61,76.45 156.46,76.45 155.19,75.18 155.19,59.94 152.65,57.4 138.68,57.4 v138.68,58.77
ALIM_MOT
  Top 1.016: S_MOTORI.1 42.22,76.66 C11.2
  Bottom 0.508: MOTOR_DRIVER_D.VIN0 167.84,134.87 167.84,133.73 167.84,132.44 MOTOR_DRIVER_D.VIN1 | MOTOR_DRIVER_A.VIN0 47.3,123.44 47.3,124.71 47.3,126.03 MOTOR_DRIVER_A.VIN1 | MOTOR_DRIVER_C.VIN1 167.84,100.58 167.84,101.85 167.84,103.17 MOTOR_DRIVER_C.VIN0 | 48.51,124.66 MOTOR_DRIVER_A.VIN2 | 166.62,101.8 MOTOR_DRIVER_C.VIN2 | 49.89,76.66 S_MOTORI.1 50.04,76.81 49.9,77.64 | MOTOR_DRIVER_B.VIN0 47.3,91.74 48.51,91.74 | MOTOR_DRIVER_B.VIN1 MOTOR_DRIVER_B.VIN2
  Bottom 4: 161.54,103.12 162.81,101.85 MOTOR_DRIVER_C.VIN2 167.84,101.85 167.89,101.85 | MOTOR_DRIVER_D.VIN2 168.15,133.6 168.27,133.73 167.84,133.73 162.94,133.73 161.54,132.33 161.54,103.12 | 46.86,124.71 47.3,124.71 MOTOR_DRIVER_A.VIN2 51.05,124.71 56.13,119.63 56.13,96.77 52.32,92.96 MOTOR_DRIVER_B.VIN2 48.51,91.74 48.51,81.6 49.82,80.3 | 161.54,103.12 153.92,95.5 153.92,85.34 146.3,77.72 92.96,77.72 90.3,80.39 49.91,80.39 49.82,80.3 | 49.82,80.3 49.9,80.21 49.9,77.64 48.92,76.66
BUZPIN
  Top 0.305: U$1.30 129.9,147.52 129.9,145.39 153.82,121.46 153.82,118.41 SG1.+
GND  (via drill 0.51)  (1 unrouted)
  Top 0.406: U$2.19 102.49,83.44 101.72,82.67 C1.2
  Top 0.508: 79.86,91.69 MOTOR_DRIVER_B.GND 82.96,91.59 102.39,91.59 | 79.86,91.69 77.85,91.69 C15.1 | C14.1 80.37,123.31 | 80.37,123.31 81.4,123.31 81.53,123.44 MOTOR_DRIVER_A.GND | MOTOR_DRIVER_C.GND 134.77,103.12 | 134.77,103.12 C13.1 | MOTOR_DRIVER_D.GND 134.77,134.87 | 134.77,134.87 136.52,134.87 C12.1 137.64,135.13 146.05,126.72 146.05,118.57 SG1.- 146.2,118.41 134.47,106.68 | U$2.8 105.03,94.23 102.39,91.59 | J1.4 120.65,92.71 | S8.2 33.27,136.63 33.27,133.6 37.08,129.79 MOTOR_DRIVER_A.GND3 | S2.2 174.53,128.52 | 174.53,128.52 MOTOR_DRIVER_D.GND3 | 174.53,128.52 174.53,128.24 175.51,127.25 178.05,127.25 183.13,122.17 CS2.2 188.11,122.07 190.09,120.09 190.09,105.77 192.23,103.63 193.9,103.63 195.58,105.31 | J5.4 101.39,178.05 J4.4 101.39,182.32 | 101.39,182.32 100.58,183.13 87.88,183.13 86.15,181.4 J6.4 83.57,180.59 78.53,175.56 J8.4 78.53,170.23 78.49,170.18 79.5,169.16 91.31,169.16 91.31,169.24 J7.4 | US_OVEST.5 132.33,170.56 US_NORD.5 US_EST.5 | US_EST.5 US_SUD.5 132.18,193.4 132.18,204.22 128.22,208.18 H4.B3,0 | v76.56,153.82 76.56,147.68 U$1.GND | SV4.1 106.88,186.84 105.97,186.84 101.55,182.42 101.39,182.32 | US_EST.5 132.49,185.32 138.89,185.32 139.95,186.38 140.41,186.38 S4.2 140.48,187.12 142.09,188.72 164.8,188.72 | 160.99,172.67 155.19,172.67 LED1.1 | 166.01,167.64 160.99,172.67 | 166.01,167.64 167.69,167.64 168,167.94 S3.2 168.3,168.1 170.59,168.1 173.79,164.9 192.99,164.9 H2.B3,0 | SW_DEBUG.3 159,160.63 166.01,167.64 | 164.8,188.72 164.8,176.48 160.99,172.67 | 164.8,188.72 164.8,192.94 H3.B3,0 | 190.55,70.71 192.99,68.27 192.99,51.66 H15.B3,0 | 190.55,70.71 186.59,74.68 186.59,75.29 S16.2
  Top 0.508: 195.58,105.31 208.23,92.66 208.23,88.39 H16.B3,0 208.08,88.24 190.55,70.71 | 195.58,105.31 192.99,107.9 S1.2 193.45,107.75 208.23,122.53 208.23,128.02 H1.B3,0 | 25.65,88.39 25.65,77.88 28.09,75.44 | 25.65,88.39 25.65,91.59 CS3.2 25.5,91.9 23.83,93.57 23.83,96.77 24.74,97.69 24.74,106.68 23.52,107.9 23.06,107.9 S9.2 22.76,108.05 8.28,122.53 8.28,128.02 H8.B3,0 | 28.09,75.44 29.31,75.44 S10.2 | 25.65,88.39 8.28,88.39 H9.B3,0 | 28.09,75.44 23.52,70.87 23.52,51.66 H10.B3,0 23.67,51.51 37.85,51.51 42.77,46.58 46.33,46.58 47.6,47.85 S11.2 47.9,47.85 48.97,47.85 50.34,49.22 52.93,49.22 54.86,49.78 | S13.2 108.41,23.01 108.41,24.74 109.63,25.96 121.41,25.96 123.57,28.12 CS4.2 123.8,28.19 125.48,26.52 128.22,26.52 | 128.22,26.52 138.89,26.52 140.41,28.04 140.41,29.41 S14.2 | 128.22,26.52 128.22,8.23 H13.B3,0 | 134.77,134.87 134.77,138.58 133.45,139.9 132.33,139.9 MOTOR_DRIVER_D.GND1 | MOTOR_DRIVER_C.GND1 132.94,108.2 134.47,106.68 | 134.47,106.68 134.77,106.37 134.77,103.12 | 79.86,91.69 79.86,88.29 81.43,86.72 82.8,86.72 MOTOR_DRIVER_B.GND1 | 80.37,123.31 80.37,120.24 82.19,118.41 82.8,118.41 MOTOR_DRIVER_A.GND1 | CS1.2 61.03,172.92 59.94,172.92 | 59.94,172.92 57.71,172.92 52.88,168.1 50.34,168.1 | 50.34,168.1 47.9,168.1 S7.2 | MOTOR_DRIVER_B.GND0 47.3,96.77 MOTOR_DRIVER_B.GND3 47.3,99.36 MOTOR_DRIVER_B.GND2 | 147.12,60.5 IC1.5 147.35,60.5 | MOTOR_DRIVER_A.GND0 47.3,128.63 MOTOR_DRIVER_A.GND3 | MOTOR_DRIVER_A.GND2 47.3,131.06 MOTOR_DRIVER_A.GND3 | MOTOR_DRIVER_C.GND2 167.84,95.55 167.84,96.77 167.84,98.15 MOTOR_DRIVER_C.GND0 | MOTOR_DRIVER_D.GND2 167.84,127.25 MOTOR_DRIVER_D.GND3
  Top 0.508: MOTOR_DRIVER_D.GND0 167.84,129.84 MOTOR_DRIVER_D.GND3 | 75.49,44.7 75.49,29.57 S12.2 | 164.49,47.85 158.85,47.85 152.45,54.25 151.89,54.48 | 164.49,47.85 168,47.85 S15.2 | 50.34,168.1 50.49,167.94 50.49,150.11 55.52,145.08 WEBBECAMMME.4 | H11.B3,0 51.56,23.47 51.56,35.97 58.73,43.13 59.94,44.7 | 164.49,47.85 164.49,45.26 164.8,44.96 164.8,23.47 H14.B3,0 | H7.B3,0 23.52,164.9 42.11,164.9 45.62,168.4 47.3,168.4 47.6,168.1 S7.2 | H6.B3,0 51.41,192.94 51.41,174.19 47.45,170.23 47.45,168.55 S7.2 | C1.2 101.85,81.84 101.85,72.39 105.51,68.73 105.51,60.05 C8.- | 59.94,172.92 12C_AUX.5 | 102.39,91.59 102.49,91.49 U$2.19 | 116.59,60.65 116.64,60.65 116.59,58.67
  Top 0.813: IC1.3 143.76,61.98 | 143.76,61.98 143.89,61.98 144.51,62.6 146.42,62.6 147.17,61.85 147.19,61.85 147.19,60.53 IC1.5 | C4.2 137.81,62.6 143.14,62.6 143.76,61.98
  Top 1.016: 117.09,58.67 116.59,58.67
  Top 1.27: C5.- 68.52,57.34 66.42,55.25 C6.1 67.69,53.59 68.58,52.7 68.58,51.08 R3.1 68.61,43.66 68.83,43.43 68.83,44.7 | C8.- 105.6,57.34 103,54.74 C9.1 104.39,53.59 105.66,52.32 105.56,52.22 R7.1 105.56,49.68 103.12,47.24 103.12,44.7 | R4.1 151.11,53.7 151.89,54.48 151.89,58.17 149.56,60.5 147.35,60.5 | J16.2 92.96,57.4 90.42,59.94 | 90.42,59.94 C3.- | 86.61,59.94 C3.- | C3.- 87.63,59.88 87.63,58.04 85.47,55.88 C7.1 85.6,53.47 86.87,53.47 87.66,52.68 R6.1 89.15,49.55 89.15,44.7 | J17.2 90.42,59.94 | C4.2 136.27,64.9 132.52,68.64 C2.- 126.81,68.64 126.11,67.94 126.11,58.67
  Top 2: 126.11,59.12 126.11,58.67 D1.2 125.88,57.4
  Top 2.54: 122.17,58.67 126.11,58.67 | 116.59,59.31 115.57,60.32
  Top 4: MOTOR_DRIVER_A.GND3 53.59,129.79 56.67,126.71 56.67,98.04 | 56.67,98.04 56.67,65.66 54.86,63.85 54.86,49.78 59.94,44.7 68.83,44.7 75.49,44.7 89.15,44.7 103.12,44.7 104.39,43.43 104.39,41.15 | 104.39,41.15 BAT_12V1.2 104.39,37.08 | 47.24,98.04 MOTOR_DRIVER_B.GND3 56.67,98.04 | 167.89,128.52 MOTOR_DRIVER_D.GND3 161.54,128.52 161.54,96.77 | 116.59,59.31 116.59,60.65 116.59,66.67 127.64,77.72 142.49,77.72 161.54,96.77 | 116.59,58.67 116.59,53.34 104.39,41.15 | 161.54,96.77 167.84,96.77 167.89,96.77 | 117.09,58.67 122.17,58.67
  Bottom 0.508: 78.49,170.38 78.49,169.67 78.99,169.16 U$1.AGND 78.84,162.61 76.56,160.32 v76.56,153.82 | 78.49,170.38 78.49,171.66 J8.4 | J5.4 107.82,171.62 107.82,169.93 112.01,165.73 U$1.GND2 112.07,162.61 112.07,161.24 118.01,155.3 122.12,155.3 122.12,155.14 122.28,154.99 141.53,154.99 | 55.65,145.01 WEBBECAMMME.4 55.52,144.78 55.52,136.85 48.67,130 MOTOR_DRIVER_A.GND3 48.51,129.84 | SW_DEBUG.3 SW_DEBUG1.3 146.51,154.99 141.53,154.99 | J6.4 82.04,180.59 76.25,186.38 75.49,186.38 S6.2 | 101.4,185.93 107.95,192.48 107.95,192.94 S5.2 | 101.4,185.93 J4.4 | 101.4,185.93 98.96,188.37 90.88,188.37 J15.2 J18.2 90.58,193.4 88.44,195.53 88.44,208.18 H5.B3,0 | H12.B3,0 88.44,8.23 93.78,8.23 108.41,22.86 S13.2 108.26,23.01 108.26,34.44 104.45,38.25 BAT_12V1.2 | SG1.- 156.11,128.17 156.11,131.52 154.43,133.2 154.43,136.09 J3.4 | J1.4 123.65,95.71 123.65,98.15 128.52,103.02 132.33,103.02 MOTOR_DRIVER_C.GND | 91.03,118.26 99.26,110.03 99.26,109.58 BLUTUTTU.4 | 91.03,118.26 82.8,118.26 MOTOR_DRIVER_A.GND1 81.64,118.36 79.1,115.82 79.1,93.57 80.92,91.74 82.8,91.74 MOTOR_DRIVER_B.GND | SV2.3 105.66,132.89 91.03,118.26 | 141.53,154.99 141.53,142.9 138.58,139.95 MOTOR_DRIVER_D.GND1 | 12C_AUX.5 59.94,169.67 60.66,170.38 78.49,170.38
M1_INA  (via drill 0.6)
  Top 0.305: v87.88,145.03 v106.93,145.03
  Bottom 0.305: MOTOR_DRIVER_A.INA 86.61,145.03 v87.88,145.03 | v106.93,145.03 U$1.11/MOSI
M1_INB  (via drill 0.51)
  Top 0.305: v90.58,142.04 109.02,142.04 109.47,142.49 U$1.12/MISO
  Bottom 0.305: v90.58,142.04 90.58,136.09 83.11,128.63 82.8,128.63 MOTOR_DRIVER_A.INB
M1_PWM
  Bottom 0.305: 84.18,147.68 U$1.2 | 82.8,136.25 MOTOR_DRIVER_A.PWM | 84.18,147.52 U$1.2 | 83.11,136.25 MOTOR_DRIVER_A.PWM | U$1.2 84.07,146.3 82.8,145.03 81.53,145.03 78.99,142.49 78.99,137.41 80.26,136.14 MOTOR_DRIVER_A.PWM
M2_INA
  Bottom 0.305: U$1.24 114.5,147.52 114.5,142.21 116.94,139.78 116.94,110.41 106.96,100.43 94.39,100.43 85.39,109.42 82.8,109.42 MOTOR_DRIVER_B.INA
M2_INB
  Top 0.305: U$1.25 117.09,114.4 108.28,105.59 95.43,105.59 86.61,96.77 MOTOR_DRIVER_B.INB 82.96,96.77
M2_PWM  (via drill 0.51)
  Top 0.305: 82.96,104.39 MOTOR_DRIVER_B.PWM 86.49,104.39 87.76,105.66 87.88,105.66 87.88,109.47 91.69,113.28 91.69,114.58 91.64,114.63 v91.64,133.4
  Bottom 0.305: v91.64,133.4 91.64,147.52 U$1.5
M3_INA
  Top 0.305: MOTOR_DRIVER_C.INA 132.28,85.29 128.22,85.29 126.09,87.43 126.09,101.19 119.69,107.59 119.69,147.52 U$1.26
M3_INB
  Top 0.305: U$1.27 122.12,147.52 122.12,106.91 130.89,98.15 132.33,98.15 MOTOR_DRIVER_C.INB
M3_PWM  (via drill 0.51)
  Top 0.305: v150.62,147.52 150.62,154.84 149.4,156.06 103.38,156.06 95,147.68 94.23,147.68 U$1.6
  Bottom 0.305: v150.62,147.52 150.62,141.88 158.24,134.26 158.24,116.13 132.64,90.53 132.33,90.53 MOTOR_DRIVER_C.PWM
M4_INA
  Bottom 0.305: U$1.22/A8 86.61,160.27 87.88,159 109.47,159 117.09,151.38 137.41,151.38 138.68,150.11 138.68,145.67 136.78,143.76 128.52,143.76 127.25,142.49 127.25,118.36 128.52,117.09 MOTOR_DRIVER_D.INA
M4_INB  (via drill 0.51)
  Top 0.305: U$1.21/A7 89.08,162.74 v89.08,160.66
  Bottom 0.305: v89.08,160.66 110.01,160.66 116.69,153.97 138.63,153.97 139.95,152.65 139.95,145.03 137.41,142.49 129.79,142.49 128.52,141.22 128.52,131.09 129.92,129.69 132.23,129.69 MOTOR_DRIVER_D.INB
M4_PWM  (via drill 0.6)
  Top 0.305: v124.71,122.17 MOTOR_DRIVER_D.PWM
  Bottom 0.305: U$1.23/A9 84.07,160.27 86.61,157.73 108.2,157.73 115.82,150.11 136.14,150.11 137.41,148.84 137.41,146.3 136.14,145.03 127.25,145.03 124.71,142.49 v124.71,122.17
MA_A
  Top 1.27: MOTOR_DRIVER_A.OUTA 40.89,138.68 MOT_A.1 40.89,141.22 MOTOR_DRIVER_A.OUTA2
  Top 2.54: MOT_A.1 MOTOR_DRIVER_A.OUTA3
MA_B
  Top 1.27: MOTOR_DRIVER_A.OUTB 40.89,133.6 MOT_A.2 40.89,136.14 MOTOR_DRIVER_A.OUTB1
  Top 2.54: MOT_A.2 MOTOR_DRIVER_A.OUTB3
MB_A
  Top 1.27: MOTOR_DRIVER_B.OUTA2 40.89,109.47 MOT_B.1 40.89,106.93 MOTOR_DRIVER_B.OUTA
  Top 2.54: MOT_B.1 MOTOR_DRIVER_B.OUTA3
MB_B
  Top 1.27: MOTOR_DRIVER_B.OUTB1 40.89,104.39 MOT_B.2 40.89,101.85 MOTOR_DRIVER_B.OUTB
  Top 2.54: MOT_B.2 MOTOR_DRIVER_B.OUTB3
MC_A
  Top 1.27: MOTOR_DRIVER_C.OUTA 174.24,87.88 MOT_C.1 174.24,85.34 MOTOR_DRIVER_C.OUTA2
  Top 2.54: MOT_C.1 MOTOR_DRIVER_C.OUTA3
MC_B
  Top 1.27: MOTOR_DRIVER_C.OUTB 174.24,92.96 MOT_C.2 174.24,90.42 MOTOR_DRIVER_C.OUTB1
  Top 2.54: MOT_C.2 MOTOR_DRIVER_C.OUTB3
MD_A
  Top 1.27: MOTOR_DRIVER_D.OUTA2 174.24,117.09 MOT_D.1 174.24,119.63 MOTOR_DRIVER_D.OUTA
  Top 2.54: MOT_D.1 MOTOR_DRIVER_D.OUTA3
MD_B
  Top 1.27: MOTOR_DRIVER_D.OUTB 174.24,124.71 MOT_D.2 174.24,122.17 MOTOR_DRIVER_D.OUTB1
  Top 2.54: MOT_D.2 MOTOR_DRIVER_D.OUTB3
N$1
  Top 0.508: U$2.1 113.92,99.82 115.57,101.47 R1.1 118.74,100.21 J1.6
N$2
  Top 0.508: J1.3 115.95,90.42 113.92,88.39 U$2.28
N$3
  Top 0.508: J1.2 120.78,87.76 118.49,87.76 115.44,84.71 115.44,84.58 113.54,84.58 112.65,85.47 U$2.27
N$4
  Top 0.508: U$1.13/SCK 109.47,161.54 112.01,159 137.41,159 150.11,171.7 151.25,171.7 R2.1
N$5
  Top 0.508: R2.2 155.16,174.37 LED1.2
N$6  (via drill 0.51, 0.6)
  Top 0.305: C15.2 77.85,94.23 | C14.2 77.85,125.98 | C13.2 137.03,100.58 | MOTOR_DRIVER_C.VDD 131.88,100.58 | 132.33,132.28 MOTOR_DRIVER_D.VDD | 132.03,53.19 132.03,51.05 U$3.P$2 132.03,53.19 | 132.03,53.19 132.03,54.1 133.71,55.78 138.28,55.78 141.94,59.44 141.94,60.5 IC1.2 | 132.03,53.19 126.24,53.19 D1.1 | 83.41,125.88 82.8,125.88 MOTOR_DRIVER_A.VDD | 130.2,113.69 v130.12,113.82
  Top 0.508: 77.85,125.98 MOTOR_DRIVER_A.VDD | 137.03,100.58 MOTOR_DRIVER_C.VDD 130.82,100.58 125.98,105.42 125.98,109.47 130.2,113.69 130.3,113.79 135.38,113.79 136.78,115.19 C12.2 MOTOR_DRIVER_D.VDD | v121.59,55.02 121.59,54.89 123.41,53.07 D1.1 | v100.48,74.52 100.48,76.35 v95.91,80.92 | C14.2 75.31,126.11 71.37,122.17 71.37,98.04 75.18,94.23 77.85,94.23 MOTOR_DRIVER_B.VDD v90.58,94.23
  Bottom 0.305: 95.61,80.92 v95.91,80.92 | v90.58,94.23 90.58,94.34 90.53,94.39 | 82.8,94.18 MOTOR_DRIVER_B.VDD
  Bottom 0.508: 95.61,80.92 90.58,85.95 v90.58,94.23 | v130.12,113.82 121.97,113.82 104.22,96.06 92.2,96.06 90.53,94.39 | v100.48,74.52 101.09,73.91 110.74,73.91 121.59,63.07 v121.59,55.02
N$7
  Top 1.27: R4.2 148.44,56.54 147.57,57.4 | R5.2 147.57,56.16 147.57,57.4 | IC1.4 145.47,58.11 146.18,57.4 147.57,57.4
N$8
  Top 1.27: LED2.1 R3.2
N$10
  Top 1.27: LED3.1 R6.2
N$12
  Top 1.27: LED4.1 R7.2
N$13
  Top 0.152: -1.52,72.52 -1.65,72.64
N$14
  Top 1.016: C11.1 43.43,72.64 S_MOTORI.2 | S_ELETTR..2 169.29,72.64 C10.1
  Top 2.54: S_ELETTR..2 S_ELETTR..3 | S_MOTORI.2 S_MOTORI.3
  Bottom 0.305: S_MOTORI.2 49.89,72.69 49.78,71.37
  Bottom 4: 49.78,71.37 49.78,54.86 59.94,44.7 96.77,44.7 99.31,42.16 BAT_12V1.1 99.31,43.43 100.58,44.7 120.9,44.7 127.25,38.35 148.84,38.35 162.81,52.32 S_ELETTR..3 162.81,71.37
POWER_BLOK_1
  Top 0.305: 77.62,186.23 77.62,186.84 | 77.62,186.23 77.62,186.21 91.97,186.21 96.16,190.4 107.85,190.4 110.39,192.94 S5.3 | 77.62,186.84 77.62,187.45 S6.3 77.62,186.84 | 77.62,186.23 70.58,179.19 RB1.2 61.08,179.32 59.94,179.32 59.94,179.07 58.17,177.29 | S7.3 49.73,169.93 50.8,169.93 58.17,177.29 | CS1.1 59.81,175.64 58.17,177.29
  Bottom 0.305: S8.3 30.53,142.95 30.53,148.44 49.58,167.49 49.58,169.77 S7.3
POWER_BLOK_2
  Top 0.305: S2.3 187.5,138.07 190.86,134.72 190.86,126.03 RB2.2 190.86,125.88 190.86,122.22 CS2.1 191.01,122.07 191.01,107.59 192.84,105.77 192.84,105.46 S1.3
  Bottom 0.305: S4.3 142.85,185.47 153.06,185.47 169.82,168.71 169.82,166.27 S3.3 169.98,166.12 188.26,147.83 188.26,139.75 187.5,138.99 187.5,138.23 S2.3
POWER_BLOK_3
  Top 0.305: S9.3 23.06,110.49 23.06,110.18 30.99,102.26 30.99,98.15 28.4,95.55 RB3.2 28.4,95.4 28.4,91.74 CS3.1 28.4,91.59 28.4,77.88 S10.3 28.55,77.72 33.43,77.72 45.92,65.23 45.92,49.68 S11.3
  Bottom 0.305: S12.3 73.05,30.48 67.56,30.48 48.51,49.53 46.08,49.53 S11.3
POWER_BLOK_4
  Top 0.305: 120.75,29.87 120.75,32 RB4.2 | 120.75,29.87 120.75,28.19 | 120.75,28.19 108.61,28.19 105.97,25.55 105.97,23.01 S13.3 | 120.75,28.19 CS4.1 | 120.75,29.87 124.56,29.87 125.93,28.5 138.12,28.5 S14.3
  Bottom 0.305: S16.3 185.37,73 166.32,53.95 166.32,46.18 S15.3 166.17,46.02 154.69,34.54 140.56,34.54 138.28,32.26 138.28,28.5 S14.3
RX1
  Bottom 0.508: WEBBECAMMME.1 62.61,145.97 78.64,145.97 78.84,146.18 78.99,146.18 U$1.0/RX
RX2
  Bottom 0.508: BLUTUTTU.3 101.85,111 113.28,122.43 113.28,137.79 111.25,139.83 107.44,139.83 101.85,145.41 U$1.9/CS
RX3  (via drill 0.51, 0.6)
  Top 0.305: v98.5,89.15 98.65,89.15 99.87,87.93 99.87,87.17 U$2.17 | v95.23,94.54 95.23,99.59 99.72,104.09 v105.05,104.09 | v108.2,143.76 v96.77,143.76
  Bottom 0.305: v98.5,89.15 98.5,93.83 98.1,94.23 98.04,94.23 97.74,94.54 v95.23,94.54 | v105.05,104.09 115.77,114.81 115.77,138.99 111,143.76 v108.2,143.76 | U$1.7 v96.77,143.76
RX4
  Top 0.305: J3.1 148.34,136.25 143.61,136.25 132.33,147.52 U$1.31/A12
S1_DOWN
  Bottom 0.508: U$1.34/A15 132.33,165.35 134.62,167.64 134.62,171.96 133.1,173.48 117.86,173.48 117.22,174.12 109.86,174.12 105.28,178.69 105.39,178.8 J4.2
S1_UP
  Bottom 0.508: J4.1 112.58,175.41 133.88,175.41 136.3,172.99 136.3,166.35 134.87,164.93 U$1.33/A14
S2_DOWN
  Bottom 0.508: J5.2 118.09,165.35 125.98,165.35 127.25,164.08 U$1.36/A17
S2_UP
  Bottom 0.508: J5.1 118.82,166.62 128.52,166.62 129.79,165.35 U$1.35/A16
S3_DOWN
  Top 0.508: U$1.14/A0 106.93,164.08 104.39,166.62 104.39,170.43 100.58,174.24 95.12,174.24 90.15,179.21 J6.2
S3_UP
  Top 0.508: J6.1 92.96,180.59 98.04,175.51 101.85,175.51 105.66,171.7 105.66,167.89 106.93,166.62 117.09,166.62 119.63,164.08 U$1.39/A20
S4_DOWN
  Bottom 0.508: J7.2 97.77,169.05 101.85,164.97 U$1.16/A2
S4_UP
  Bottom 0.508: J7.1 99.77,169.34 104.39,164.72 U$1.15/A1
S5_DOWN
  Bottom 0.508: J8.2 82.53,170.07 86.49,166.12 90.17,166.12 91.69,164.59 U$1.20/A6
S5_UP
  Bottom 0.508: J8.1 84.53,171.24 87.88,167.89 96.77,167.89 99.31,165.35 U$1.17/A3
SCL_I2C
  Top 0.508: U$1.19/A5/SCL 94.23,158.62 92.96,157.35 75.44,157.35 71.37,153.29 71.37,145.03 73.15,143.26 84.45,143.26 88.39,139.32 100.08,139.32 100.58,138.81 SV2.5
SCL_I2C1
  Top 0.508: U$1.37/A18 124.71,165.35 127.25,167.89 127.25,170.43 US_OVEST.3 127.25,170.56 US_NORD.3 US_EST.3 US_SUD.3
SCL_I2C2
  Bottom 0.305: U$1.3/CANTX 86.61,149.71 85.22,151.1 74.63,151.1 65.13,160.6 65.13,167.79 12C_AUX.3
SDA_I2C
  Top 0.508: U$1.18/A4/SDA 96.77,157.48 95.12,155.83 75.95,155.83 73.28,153.16 73.28,146.05 74.65,144.68 85.32,144.68 89.41,140.59 101.35,140.59 103.12,138.81 SV2.4
SDA_I2C1
  Top 0.508: U$1.38/A19 122.17,165.35 124.71,167.89 124.71,170.31 US_OVEST.2 124.71,170.56 US_NORD.2 US_EST.2 US_SUD.2
SDA_I2C2
  Bottom 0.305: 12C_AUX.2 67.56,160.48 75.69,152.35 86.54,152.35 89.15,149.73 U$1.4/CANRX
SP1  (via drill 0.51)
  Top 0.305: v105.05,89.56 105.05,87.17 U$2.21 | v160.53,136.7 v154.74,130.91 | v188.72,117.2 v186.28,119.63
  Bottom 0.305: v105.05,89.56 105.05,93.32 123.37,111.63 135.46,111.63 v154.74,130.91 | v160.53,136.7 164.34,140.51 165.41,140.51 v186.28,119.63 | v188.72,117.2 188.72,114.76 192.84,110.64 S1.1
SP2  (via drill 0.51)
  Top 0.305: v106.27,90.73 106.27,87.17 U$2.22 | v157.18,126.49 157.18,130.91 163.73,137.46 163.73,139.9 166.62,142.8 v173.33,142.8
  Bottom 0.305: v106.27,90.73 106.27,93.24 123.29,110.26 144.55,110.26 150.11,115.82 150.11,118.36 157.18,125.42 v157.18,126.49 | v173.33,142.8 185.37,142.8 S2.1
SP3  (via drill 0.51)
  Top 0.305: v112.98,81.08 107.64,86.41 107.64,87.17 U$2.23 | v135.51,80.95 158.85,104.29 158.85,129.69 166.93,137.77 171.35,137.77 v171.96,138.38
  Bottom 0.305: v135.51,80.95 113.11,80.95 v112.98,81.08 | v171.96,138.38 171.96,161.85 166.32,167.49 166.32,169.77 S3.1
SP4  (via drill 0.51)
  Top 0.305: v161.6,143.87 161.6,136.25 156.11,130.76 156.11,114.91 148.44,107.24 148.44,97.05 134.8,83.41 123.65,83.41 122.38,82.14 113.13,82.14 108.86,86.41 108.86,87.17 U$2.24
  Bottom 0.305: v161.6,143.87 161.6,147.68 162.66,148.74 162.66,161.85 138.28,186.23 138.28,187.45 S4.1
SP5  (via drill 0.51)
  Top 0.305: v114.35,90.53 112.67,90.53 110.24,88.09 110.24,87.17 U$2.25 | v151.54,101.68 151.54,106.5 158.24,113.21 158.24,130 166.62,138.38 170.43,138.38 174.4,142.34 174.4,148.13 v161.44,161.09 | v114.91,194.62 107.04,194.62 105.51,193.09 S5.1
  Bottom 0.305: v151.54,101.68 151.54,100.15 134.7,83.31 119.63,83.31 115.32,87.63 115.32,89.56 v114.35,90.53 | v161.44,161.09 160.83,161.09 130.81,191.11 118.42,191.11 v114.91,194.62
SP6  (via drill 0.51)
  Top 0.305: v109.02,104.09 121.89,104.09 124.59,101.4 124.59,85.78 122.63,83.82 113.28,83.82 111.45,85.65 111.45,87.17 U$2.26 | v88.52,115.75 88.52,122.91 84.18,127.25 81.43,127.25 69.57,139.12 v69.57,153.64
  Bottom 0.305: v109.02,104.09 106.88,101.96 101.7,101.96 96.88,106.78 93.78,106.78 88.52,112.04 v88.52,115.75 | v69.57,153.64 69.42,153.64 57.91,165.15 57.91,173.84 69.55,185.47 73.05,185.47 S6.1
SP7  (via drill 0.51)
  Top 0.305: v92.3,93.47 100.43,93.47 101.09,94.13 101.09,96.16 U$2.11 | v92.28,86.33 92.28,84.68 90.12,82.52 78.87,82.52 60.22,101.17 60.22,136.45 46.08,150.6 46.08,166.12 S7.1
  Bottom 0.305: v92.3,93.47 92.3,86.36 v92.28,86.33
SP8  (via drill 0.51)
  Top 0.305: v100.02,102.11 100.02,96.32 U$2.12 | v83.72,115.52 78.49,115.52 v76.35,117.65 | v57.61,136.27 57.58,136.27 48.49,145.36 29.39,145.36 26.37,142.34 26.37,140.26 28.4,138.23 S8.1
  Bottom 0.305: v76.35,117.65 57.73,136.27 v57.61,136.27 | v83.72,115.52 83.72,115.42 96.01,103.12 99.31,103.12 100.02,102.41 v100.02,102.11
SP9  (via drill 0.51)
  Top 0.305: v98.65,101.5 98.65,96.32 U$2.13 | v74.68,113.99 v81.74,113.99 | v56.69,131.98 56.69,135.23 48.62,143.31 v34.11,143.31
  Bottom 0.305: v98.65,101.5 95.63,101.5 83.13,113.99 v81.74,113.99 | v74.68,113.99 v56.69,131.98 | v34.11,143.31 32.23,141.43 32.23,114.63 23.06,105.46 S9.1
SP10  (via drill 0.6)
  Top 0.305: U$2.14 97.41,98.04 v96.77,98.68 | v38.35,86.61 v52.32,86.61
  Bottom 0.305: v96.77,98.68 91.06,98.68 89.15,96.77 89.15,89.15 85.14,85.14 78.82,85.14 74.8,89.15 70.74,89.15 67.44,85.85 64.52,85.85 63.75,86.61 v52.32,86.61 | S10.1 31.23,73.91 33.27,73.91 38.35,78.99 v38.35,86.61
SP11  (via drill 0.51)
  Top 0.305: v70.05,86.56 69.95,86.46 v69.95,76.81 | v53.54,74.83 53.54,77.57 52.17,78.94 v46.84,78.94 | v88.21,85.9 90.2,87.88 96.77,87.88 96.77,87.81 U$2.15
  Bottom 0.305: v88.21,85.9 88.21,85.88 85.88,83.54 78.26,83.54 75.11,86.69 70.18,86.69 v70.05,86.56 | v69.95,76.81 55.52,76.81 v53.54,74.83 | v46.84,78.94 46.84,78.33 44.55,76.05 44.55,48.77 47.14,46.18 49.58,46.18 S11.1
SP12  (via drill 0.51)
  Top 0.305: v74.27,84.73 77.42,81.58 92.56,81.58 95.05,84.07 97.38,84.07 98.65,85.34 98.65,87.17 U$2.16 | v60.3,84.73 v60.3,74.07 | v52.78,66.14 52.78,65.53 49.89,62.64 v49.89,50.6
  Bottom 0.305: v60.3,84.73 v74.27,84.73 | v60.3,74.07 60.3,73.66 v52.78,66.14 | v49.89,50.6 50.49,50.6 69.09,32 75.34,32 77.62,29.72 77.62,28.5 S12.1
SP13  (via drill 0.51)
  Top 0.305: v112.67,98.15 112.67,96.32 U$2.2 | v106.27,80.92 106.27,69.34 108.56,67.06 v108.56,56.84 | v117.7,47.7 117.7,47.09 124.56,40.23 v124.56,36.58
  Bottom 0.305: v112.67,98.15 112.22,98.15 107.34,93.27 107.34,81.99 v106.27,80.92 | v117.7,47.7 v108.56,56.84 | v124.56,36.58 111,23.01 S13.1
SP14  (via drill 0.51)
  Top 0.305: v111.45,94.34 111.45,96.16 U$2.3 | v109.47,80.92 109.47,80.16 111.33,78.31 v111.33,57.2 | v129.64,42.44 130.73,42.44 142.7,30.48 S14.1
  Bottom 0.305: v111.45,94.34 111.45,82.45 109.93,80.92 v109.47,80.92 | v111.33,57.2 111.33,56.82 120.52,47.62 122.94,47.62 128.12,42.44 v129.64,42.44
SP15  (via drill 0.51)
  Top 0.305: v109.93,94.34 110.08,94.49 110.08,96.16 U$2.4 | v109.88,82.4 109.88,82.02 115.57,76.33 v115.57,74.52 | v156.92,53.03 166.47,53.03 169.82,49.68 S15.1
  Bottom 0.305: v115.57,74.52 133.05,57.05 134.62,57.05 136.45,55.22 136.45,53.64 137.06,53.03 v156.92,53.03 | v109.93,94.34 109.93,82.45 v109.88,82.4
SP16  (via drill 0.51)
  Top 0.305: v124.66,82.14 124.66,82.09 v117.09,74.52 | U$2.5 108.84,93.99 109.87,92.96 113.21,92.96 v113.23,92.94
  Bottom 0.305: v113.23,92.94 113.28,92.99 113.28,88.24 119.38,82.14 v124.66,82.14 | v117.09,74.52 151.69,74.52 156.11,78.94 186.28,78.94 187.35,77.88 S16.1
SW1
  Top 0.508: U$1.28 124.71,148.84 127.25,151.38 SW_DEBUG1.2
SW2
  Top 0.508: U$1.29 127.25,148.84 128.52,150.11 138.68,150.11 142.49,146.3 152.65,146.3 155.19,148.84 155.19,150.11 156.46,151.38 SW_DEBUG.2
TX1
  Bottom 0.508: U$1.1/TX 81.53,149.1 80.9,149.73 63.5,149.73 59.67,145.91 WEBBECAMMME.2
TX2
  Bottom 0.508: U$1.10/CS 104.39,145.03 108.2,141.22 111.51,141.22 114.55,138.18 114.55,121.16 104.39,111 BLUTUTTU.2
TX3  (via drill 0.6)
  Top 0.305: U$2.18 101.22,89.79 100.58,90.42 87.88,90.42 v86.61,89.15 | v94.23,125.98 94.23,113.28 90.42,109.47 90.42,104.39 v86.61,100.58
  Bottom 0.305: U$1.8 99.31,141.22 98.04,139.95 95.5,139.95 94.23,138.68 v94.23,125.98 | v86.61,100.58 v86.61,89.15
TX4
  Top 0.305: J3.2 150.32,136.25 149.56,137.01 149.56,137.16 139.19,147.52 134.93,147.52 U$1.32/A13